# Altium project SAMV71_Xplained_Ultra.PrjPCB (part 3 of 4)

## Sheet SAMV71_Xplained_Ultra_Ethernet.SchDoc: Ethernet
size A3; Organization: ATMEL Norway; Address1: Vestre Rosten 79; Address2: N-7075 TILLER; Address3: NORWAY; DocumentNumber: A09-2407; Revision: 2; SheetNumber: 10; SheetTotal: 13; PageSetup: Record=PageOptions|CenterHorizontal=True|CenterVertical=True|PrintScale=1.04|XCorrection=1.00|YCorrection=1.00|PrintKind=1|BorderSize=5000000|LeftOffset=0|BottomOffset=0|Orientation=2|PaperLength=1000|PaperWidth=1000|Scale=100|PaperSource=7|PrintQuality=-4|MediaType=1|DitherType=10|PrintScaleMode=1|PaperKind=A3 (297 x 420 mm)|PaperIndex=8
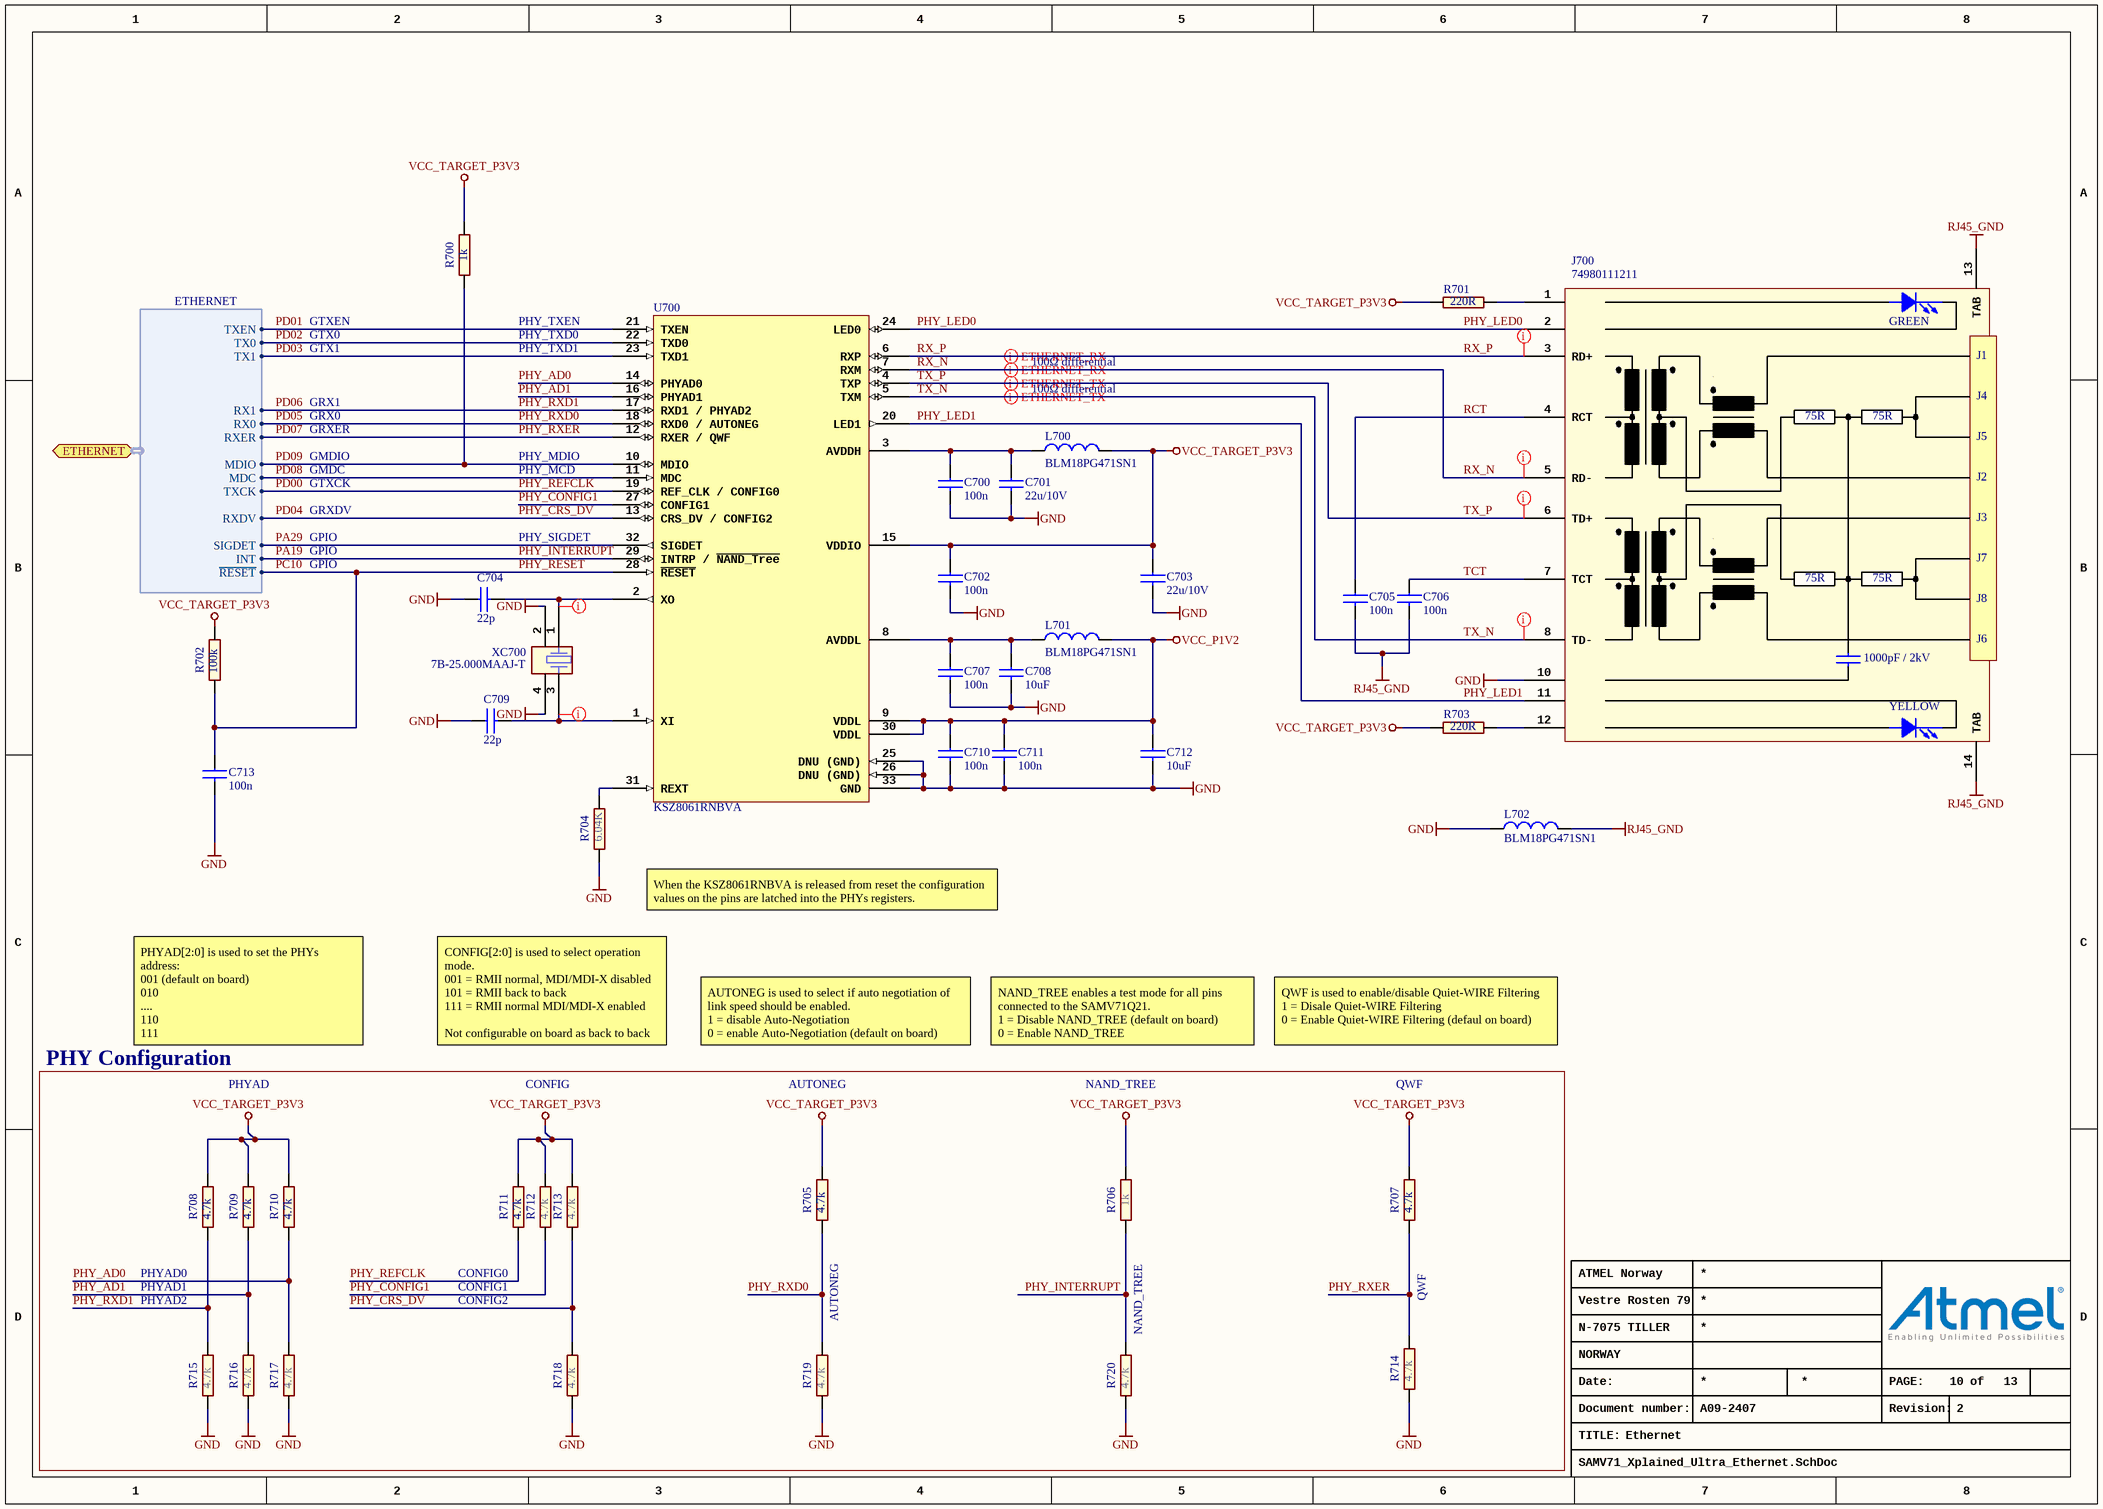
[diagram p7: SAMV71_Xplained_Ultra_Ethernet.SchDoc]

### Parts
C700  value 100n  [AP1-00001]  (hidden comment: CAP-NONPOL)
C701  value 22u/10V  [AP1-00003]  (hidden comment: CAP-NONPOL)
C702  value 100n  [AP1-00001]  (hidden comment: CAP-NONPOL)
C703  value 22u/10V  [AP1-00003]  (hidden comment: CAP-NONPOL)
C704  value 22p  [AP1-00001]  (hidden comment: CAP-NONPOL)
C705  value 100n  [AP1-00001]  (hidden comment: CAP-NONPOL)
C706  value 100n  [AP1-00001]  (hidden comment: CAP-NONPOL)
C707  value 100n  [AP1-00001]  (hidden comment: CAP-NONPOL)
C708  value 10uF  [AP1-00041]  (hidden comment: CAP-NONPOL)
C709  value 22p  [AP1-00001]  (hidden comment: CAP-NONPOL)
C710  value 100n  [AP1-00001]  (hidden comment: CAP-NONPOL)
C711  value 100n  [AP1-00001]  (hidden comment: CAP-NONPOL)
C712  value 10uF  [AP1-00041]  (hidden comment: CAP-NONPOL)
C713  value 100n  [AP1-00001]  (hidden comment: CAP-NONPOL)
J700  value 74980111211  [AP8-00749]  (hidden comment: RJ45)
L700  value BLM18PG471SN1  [AP3-00005]  (hidden comment: INDUCTOR)
L701  value BLM18PG471SN1  [AP3-00005]  (hidden comment: INDUCTOR)
L702  value BLM18PG471SN1  [AP3-00005]  (hidden comment: INDUCTOR)
R700  value 1k  [AP2-00000]  (hidden comment: R2)
R701  value 220R  [AP2-00000]  (hidden comment: R2)
R702  value 100k  [AP2-00000]  (hidden comment: R2)
R703  value 220R  [AP2-00000]  (hidden comment: R2)
R704  value 6.04K  [AP2-00000]  (hidden comment: R2)
R705  value 4.7k  [AP2-00000]  (hidden comment: R2)
R706  value 1k  [AP2-00000]  (hidden comment: R2)
R707  value 4.7k  [AP2-00000]  (hidden comment: R2)
R708  value 4.7k  [AP2-00000]  (hidden comment: R2)
R709  value 4.7k  [AP2-00000]  (hidden comment: R2)
R710  value 4.7k  [AP2-00000]  (hidden comment: R2)
R711  value 4.7k  [AP2-00000]  (hidden comment: R2)
R712  value 4.7k  [AP2-00000]  (hidden comment: R2)
R713  value 4.7k  [AP2-00000]  (hidden comment: R2)
R714  value 4.7k  [AP2-00000]  (hidden comment: R2)
R715  value 4.7k  [AP2-00000]  (hidden comment: R2)
R716  value 4.7k  [AP2-00000]  (hidden comment: R2)
R717  value 4.7k  [AP2-00000]  (hidden comment: R2)
R718  value 4.7k  [AP2-00000]  (hidden comment: R2)
R719  value 4.7k  [AP2-00000]  (hidden comment: R2)
R720  value 4.7k  [AP2-00000]  (hidden comment: R2)
U700  value KSZ8061RNBVA  [AP6-00349]  (hidden comment: KSZ8061RNB)
XC700  value 7B-25.000MAAJ-T  [AP7-00067]  (hidden comment: CRYSTAL1324)

### Blocks framed on the sheet
PHY Configuration: R705-R720

### Ports
ETHERNET (harness ETHERNET)

### Harnesses
ETHERNET: TX0, TX1, TXEN, TXCK, RX0, RX1, MDC, MDIO, RXER, RXDV, INT, ~{RESET}, SIGDET

### Nets
GND: C700.2 C701.2 C702.2 C703.2 C704.1 C707.2 C708.2 C709.1 C710.2 C711.2 C712.2 C713.2 J700.10 L702.1 R704.1 R714.2 R715.2 R716.2 R717.2 R718.1 R719.2 R720.2 U700.25(DNU_(GND)) U700.26(DNU_(GND)) U700.33(GND) XC700.2 XC700.4
RJ45_GND: C705.2 C706.2 J700.13(TAB) J700.14(TAB) L702.2
VCC_P1V2: C710.1 C711.1 C712.1 L701.1 U700.9(VDDL) U700.30(VDDL)
VCC_TARGET_P3V3: C702.1 C703.1 L700.1 R700.2 R701.2 R702.2 R703.1 R705.2 R706.2 R707.2 R708.2 R709.2 R710.2 R711.2 R712.2 R713.2 U700.15(VDDIO)
~{PHY_RESET}: C713.1 R702.1 U700.28(~{RESET}) ; port ETHERNET.~{RESET}  [also labelled PC10]
PA19: R706.1 R720.1 U700.29(INTRP_/_~{NAND_Tree}) ; port ETHERNET.INT  [also labelled PHY_INTERRUPT]
PA29: U700.32(SIGDET) ; port ETHERNET.SIGDET
PD00: R711.1 U700.19(REF_CLK_/_CONFIG0) ; port ETHERNET.TXCK  [also labelled PHY_REFCLK]
PD01: U700.21(TXEN) ; port ETHERNET.TXEN
PD02: U700.22(TXD0) ; port ETHERNET.TX0
PD03: U700.23(TXD1) ; port ETHERNET.TX1
PD04: R713.1 R718.2 U700.13(CRS_DV_/_CONFIG2) ; port ETHERNET.RXDV  [also labelled PHY_CRS_DV]
PD05: R705.1 R719.1 U700.18(RXD0_/_AUTONEG) ; port ETHERNET.RX0  [also labelled PHY_RXD0]
PD06: R708.1 R715.1 U700.17(RXD1_/_PHYAD2) ; port ETHERNET.RX1  [also labelled PHY_RXD1]
PD07: R707.1 R714.1 U700.12(RXER_/_QWF) ; port ETHERNET.RXER  [also labelled PHY_RXER]
PD08: U700.11(MDC) ; port ETHERNET.MDC
PD09: R700.1 U700.10(MDIO) ; port ETHERNET.MDIO
PHY_AD0: R710.1 R717.1 U700.14(PHYAD0)
PHY_AD1: R709.1 R716.1 U700.16(PHYAD1)
PHY_CONFIG1: R712.1 U700.27(CONFIG1)
PHY_LED0: J700.2 U700.24(LED0)
PHY_LED1: J700.11 U700.20(LED1)
RCT: C705.1 J700.4(RCT)
RX_N: J700.5(RD-) U700.7(RXM)
RX_P: J700.3(RD+) U700.6(RXP)
TCT: C706.1 J700.7(TCT)
TX_N: J700.8(TD-) U700.5(TXM)
TX_P: J700.6(TD+) U700.4(TXP)
NetC700_1: C700.1 C701.1 L700.2 U700.3(AVDDH)
NetC704_2: C704.2 U700.2(XO) XC700.1
NetC707_1: C707.1 C708.1 L701.2 U700.8(AVDDL)
NetC709_2: C709.2 U700.1(XI) XC700.3
NetJ700_1: J700.1 R701.1
NetJ700_12: J700.12 R703.2
NetR704_2: R704.2 U700.31(REXT)

### Layout directives
differential pair: RX_N, RX_P, TX_N, TX_P
rule Assembly Testpoint Usage [Testpoint - Not Allowed    Multiple - Not Allowed]; rule Fabrication Testpoint Usage [Testpoint - Not Allowed    Multiple - Not Allowed]: NetC704_2, NetC709_2, RX_N, RX_P, TX_N, TX_P

### Notes on the sheet
- GTXEN
- GTX0
- GTX1
- PHY_TXEN
- PHY_TXD0
- PHY_TXD1
- 100Ω differential
- GRX1
- GRX0
- GRXER
- GMDIO
- GMDC
- GTXCK
- GRXDV
- PHY_MDIO
- PHY_MCD
- GPIO
- PHY_SIGDET
- When the KSZ8061RNBVA is released from reset the configuration values on the pins are latched into the PHYs registers.
- PHYAD[2:0] is used to set the PHYs address:
  001 (default on board)
  010
  ....
  110
  111
- CONFIG[2:0] is used to select operation mode.
  001 = RMII normal, MDI/MDI-X disabled
  101 = RMII back to back
  111 = RMII normal MDI/MDI-X enabled
  Not configurable on board as back to back mode is not applicable for this design.
- AUTONEG is used to select if auto negotiation of link speed should be enabled.
  1 = disable Auto-Negotiation
  0 = enable Auto-Negotiation (default on board)
- NAND_TREE enables a test mode for all pins connected to the SAMV71Q21.
  1 = Disable NAND_TREE (default on board)
  0 = Enable NAND_TREE
- QWF is used to enable/disable Quiet-WIRE Filtering
  1 = Disale Quiet-WIRE Filtering
  0 = Enable Quiet-WIRE Filtering (defaul on board)
- PHYAD
- CONFIG
- AUTONEG
- NAND_TREE
- QWF
- PHYAD0
- PHYAD1
- PHYAD2
- CONFIG0
- CONFIG1
- CONFIG2
- (near R719) AUTONEG
- (near R720) NAND_TREE
- Date:
- PAGE:
- of
- TITLE:
- Document number:
- Revision:
- (in symbol A08-1816) GREEN; J1; J4; 75R; J5; J2; J3; J7; J8; J6; 1000pF / 2kV; YELLOW

### Library data of the parts
C700 C702 C705-C707 C710 C711 C713 = A01-0246: as C105 on sheet SAMV71_Xplained_Ultra_Power_Multiplexer; AN: A01-0246; Tolerance: 16V, +/-10%; Height: 0,5
C701 C703 = A01-0500: Ceramic capacitor, SMD 0805, X5R, 10V, ±20%; PartGroup: Capacitors,Ceramic,SMD 0805; Manufacturer: tdk; MPN: C2012X5R1A226M/0.85; TemperatureRange: -55°C to +85°C; AN: A01-0500; Height: 0,949999988079071
C704 C709 = A01-0019: Ceramic capacitor, SMD 0402, NP0, 50V, +/-5%; PartGroup: Capacitors,Ceramic,SMD 0402; TemperatureRange: -55 - +125 deg C; AN: A01-0019; Tolerance: 50V, +/-5%; Height: 0.550000011920929
C708 C712 = A01-0360: Ceramic capacitor, SMD 0805, X7R, 10V, 10 %, (de19441); PartGroup: Capacitors,Ceramic,SMD 0805; Manufacturer: Murata; MPN: GRM21BR61A106KE19L; Tolerance: 10%; TemperatureRange: -55 - +85 deg C; AN: A01-0360; Height: 1,25
J700 = A08-1816: 10/100Base-TX, SMD, RJ45, green and yellow LEDs, integrated magnetics; PartGroup: Mechanical devices,Connectors,Other; Manufacturer: Würth Elektronik; TemperatureRange: -40°C to +85°C; AN: A08-1816; Height: 13,6099996566772; MPN: 74980111211
L700-L702 = A03-0035: SMD RF inductor 0603. Z=470Ohm (@100MHz), Max R(dc)=0.65Ohm, Max current=1A; PartGroup: Inductors,EMI; Manufacturer: Murata; Tolerance: ±25%; TemperatureRange: -55°C to +125°C; AN: A03-0035; Height: 0,800000011920929; MPN: BLM18PG471SN1
R700 R706 = A02-0212: Thick film resistor, SMD 0402, 1/16W, 1%; PartGroup: Resistors,SMD,0402 1%; TemperatureRange: -55 - +125 deg C; AN: A02-0212; Tolerance: 1 %; Height: 0,349999994039536
R701 R703 = A02-0196: Thick film resistor, SMD 0402, 1/16W, 1%; PartGroup: Resistors,SMD,0402 1%; TemperatureRange: -55 - +125 deg C; AN: A02-0196; Tolerance: 1 %; Height: 0.349999994039536
R702 = A02-0260: as R106 on sheet SAMV71_Xplained_Ultra_Power_Supply; AN: A02-0260; Tolerance: 1 %; Height: 0,349999994039536
R704 = A02-0914: Thick film resistor, SMD 0402, 1/16W, 1%, E192; PartGroup: Resistors,SMD,0402 1%; TemperatureRange: -55 - +125 deg C; AN: A02-0914; Tolerance: 1%; Height: 0,349999994039536
R705 R707-R711 = A02-0228: Thick film resistor, SMD 0402, 1/16W, 1%; PartGroup: Resistors,SMD,0402 1%; TemperatureRange: -55 - +125 deg C; AN: A02-0228; Tolerance: 1 %; Height: 0.349999994039536
R712-R720 = A02-0228: Thick film resistor, SMD 0402, 1/16W, 1%; PartGroup: Resistors,SMD,0402 1%; TemperatureRange: -55ï¿½ to +125ï¿½C; AN: A02-0228; Tolerance: 1 %; Height: 0,349999994039536
U700 = A06-1163: 10Base-T/100Base-TX PHY, RMII, EEE, 50MHz clock output, AEC-Q100 Automotive; PartGroup: Integrated Circuits,Interface ICs,Ethernet; TemperatureRange: -40Â°C to +105Â°C; AN: A06-1163; Height: 0,850000023841858
XC700 = A07-0088: 25.000 MHz crystal, 18pF, ±30ppm, 5.0 x 3.2 mm; PartGroup: Frequency devices,Crystals,SMD; Manufacturer: TXC Corporation; TemperatureRange: -40°C to +85°C; AN: A07-0088; Tolerance: ±30ppm; Height: 1,04999995231628; MPN: 7B-25.000MAAJ-T

## Sheet SAMV71_Xplained_Ultra_Memory.SchDoc: Memory
size A3; Organization: ATMEL Norway; Address1: Vestre Rosten 79; Address2: N-7075 TILLER; Address3: NORWAY; DocumentNumber: A09-2407; Revision: 2; SheetNumber: 9; SheetTotal: 13; PageSetup: Record=PageOptions|CenterHorizontal=True|CenterVertical=True|PrintScale=1.01|XCorrection=1.00|YCorrection=1.00|PrintKind=1|BorderSize=5000000|LeftOffset=0|BottomOffset=0|Orientation=2|PaperLength=1000|PaperWidth=1000|Scale=100|PaperSource=7|PrintQuality=-4|MediaType=1|DitherType=10|PaperKind=A3 (297 x 420 mm)|PrintScaleMode=1
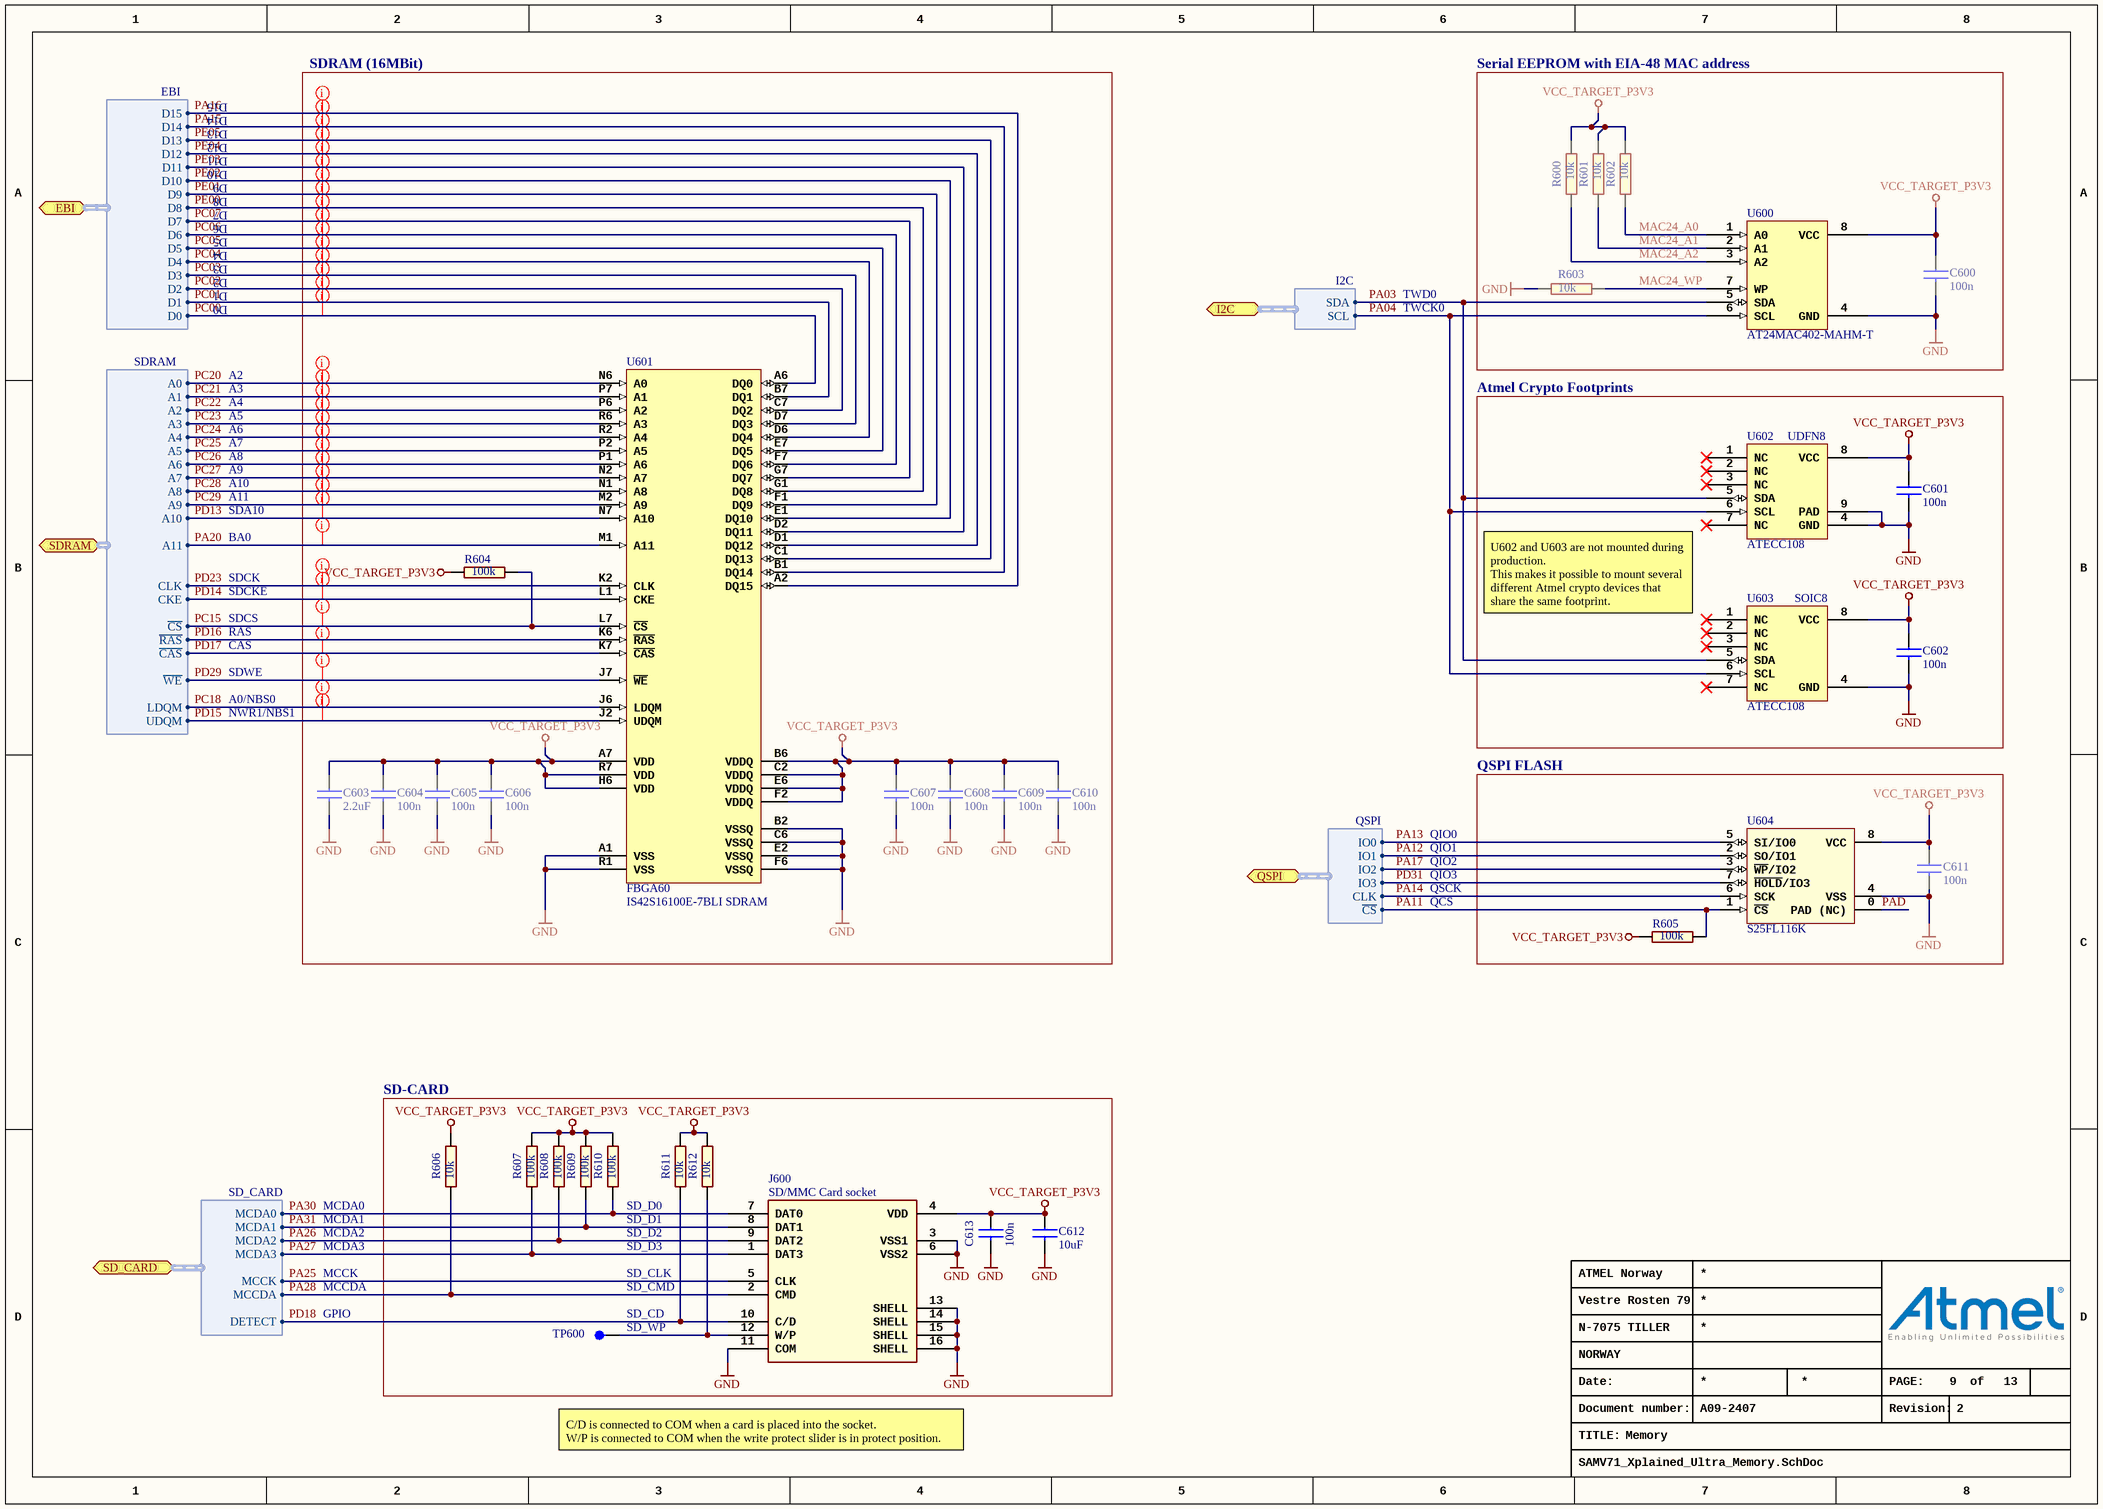
[diagram p8: SAMV71_Xplained_Ultra_Memory.SchDoc]

### Parts
C600  value 100n  [AP1-00001]  (hidden comment: CAP-NONPOL)
C601  value 100n  [AP1-00001]  (hidden comment: CAP-NONPOL)
C602  value 100n  [AP1-00001]  (hidden comment: CAP-NONPOL)
C603  value 2.2uF  [AP1-00053]  (hidden comment: Farnell no: 1288200)
C604  value 100n  [AP1-00053]  (hidden comment: CAP-NONPOL)
C605  value 100n  [AP1-00053]  (hidden comment: CAP-NONPOL)
C606  value 100n  [AP1-00053]  (hidden comment: CAP-NONPOL)
C607  value 100n  [AP1-00053]  (hidden comment: CAP-NONPOL)
C608  value 100n  [AP1-00053]  (hidden comment: CAP-NONPOL)
C609  value 100n  [AP1-00053]  (hidden comment: CAP-NONPOL)
C610  value 100n  [AP1-00053]  (hidden comment: CAP-NONPOL)
C611  value 100n  [AP1-00001]  (hidden comment: CAP-NONPOL)
C612  value 10uF  [AP1-00041]
C613  value 100n  [AP1-00001]  (hidden comment: CAP-NONPOL)
J600  SD/MMC Card socket  [AP8-00377]
R600  value 10k  [AP2-00000]  (hidden comment: R2)
R601  value 10k  [AP2-00000]  (hidden comment: R2)
R602  value 10k  [AP2-00000]  (hidden comment: R2)
R603  value 10k  [AP2-00000]  (hidden comment: R2)
R604  value 100k  [AP2-00000]  (hidden comment: R2)
R605  value 100k  [AP2-00000]  (hidden comment: R2)
R606  value 10k  [AP2-00000]  (hidden comment: R2)
R607  value 100k  [AP2-00000]  (hidden comment: R2)
R608  value 100k  [AP2-00000]  (hidden comment: R2)
R609  value 100k  [AP2-00000]  (hidden comment: R2)
R610  value 100k  [AP2-00000]  (hidden comment: R2)
R611  value 10k  [AP2-00000]  (hidden comment: R2)
R612  value 10k  [AP2-00000]  (hidden comment: R2)
TP600  TESTPOINT  [AP8-00010]  (value not drawn)  (no BOM)
U600  value AT24MAC402-MAHM-T  [AP6-00186]  (hidden comment: AT24MAC-8PIN)
U601  FBGA60  value IS42S16100E-7BLI SDRAM  [AP6-00400]
U602  value ATECC108  [AP6-00409]  (hidden comment: SOIC-8 / UDFN8 2x3mm (8MA2) footprint used for this component, usually for "not mounted" in schematics to support several Crypto devices.)
U603  value ATECC108  [AP6-00071]  (hidden comment: SOIC-8 / UDFN8 2x3mm (8MA2) footprint used for this component, usually for "not mounted" in schematics to support several Crypto devices.)
U604  value S25FL116K  [AP6-00402]  (hidden comment: Also available as 32- and 64-Mbit.)

### Blocks framed on the sheet
SDRAM (16MBit): C603-C610 R604 U601
Serial EEPROM with EIA-48 MAC address: C600 R600-R603 U600
Atmel Crypto Footprints: C601 C602 U602 U603
QSPI FLASH: C611 R605 U604
SD-CARD: C612 C613 J600 R606-R612 TP600

### Ports
EBI (harness EBI), I2C (harness I2C), QSPI (harness QSPI), SD_CARD (harness SD_CARD), SDRAM (harness SDRAM)

### Harnesses
SD_CARD: MCCDA, MCCK, MCDA3, MCDA2, MCDA1, MCDA0, DETECT
EBI: D0, D1, D2, D3, D4, D5, D6, D7, D8, D9, D10, D11, D12, D13, D14, D15
QSPI: CLK, IO3, IO2, IO0, IO1, ~{CS}
SDRAM: ~{CAS}, ~{RAS}, ~{CS}, CLK, CKE, ~{WE}, LDQM, UDQM, A0, A1, A2, A3, A4, A5, A6, A7, A8, A9, A10, A11
I2C: SDA, SCL

### Nets
GND: C600.2 C601.2 C602.2 C603.2 C604.2 C605.2 C606.2 C607.2 C608.2 C609.2 C610.2 C611.2 C612.2 C613.2 J600.3(VSS1) J600.6(VSS2) J600.11(COM) J600.13(SHELL) J600.14(SHELL) J600.15(SHELL) J600.16(SHELL) R603.1 U600.4(GND) U601.A1(VSS) U601.B2(VSSQ) U601.C6(VSSQ) U601.E2(VSSQ) U601.F6(VSSQ) U601.R1(VSS) U602.4(GND) U602.9(PAD) U603.4(GND) U604.4(VSS)
VCC_TARGET_P3V3: C600.1 C601.1 C602.1 C603.1 C604.1 C605.1 C606.1 C607.1 C608.1 C609.1 C610.1 C611.1 C612.1 C613.1 J600.4(VDD) R600.2 R601.2 R602.2 R604.1 R605.1 R606.2 R607.2 R608.2 R609.2 R610.2 R611.2 R612.2 U600.8(VCC) U601.A7(VDD) U601.B6(VDDQ) U601.C2(VDDQ) U601.E6(VDDQ) U601.F2(VDDQ) U601.H6(VDD) U601.R7(VDD) U602.8(VCC) U603.8(VCC) U604.8(VCC)
MAC24_A0: R602.1 U600.1(A0)
MAC24_A1: R601.1 U600.2(A1)
MAC24_A2: R600.1 U600.3(A2)
MAC24_WP: R603.2 U600.7(WP)
PA03: U600.5(SDA) U602.5(SDA) U603.5(SDA) ; port I2C.SDA
PA04: U600.6(SCL) U602.6(SCL) U603.6(SCL) ; port I2C.SCL
PA11: R605.2 U604.1(~{CS}) ; port QSPI.~{CS}
PA12: U604.2(SO/IO1) ; port QSPI.IO1
PA13: U604.5(SI/IO0) ; port QSPI.IO0
PA14: U604.6(SCK) ; port QSPI.CLK
PA15: U601.B1(DQ14) ; port EBI.D14
PA16: U601.A2(DQ15) ; port EBI.D15
PA17: U604.3(~{WP}/IO2) ; port QSPI.IO2
PA20: U601.M1(A11) ; port SDRAM.A11
PA25: J600.5(CLK) ; port SD_CARD.MCCK
PA26: J600.9(DAT2) R608.1 ; port SD_CARD.MCDA2
PA27: J600.1(DAT3) R607.1 ; port SD_CARD.MCDA3
PA28: J600.2(CMD) R606.1 ; port SD_CARD.MCCDA
PA30: J600.7(DAT0) R610.1 ; port SD_CARD.MCDA0
PA31: J600.8(DAT1) R609.1 ; port SD_CARD.MCDA1
PAD: U604.0(PAD_(NC))
PC00: U601.A6(DQ0) ; port EBI.D0
PC01: U601.B7(DQ1) ; port EBI.D1
PC02: U601.C7(DQ2) ; port EBI.D2
PC03: U601.D7(DQ3) ; port EBI.D3
PC04: U601.D6(DQ4) ; port EBI.D4
PC05: U601.E7(DQ5) ; port EBI.D5
PC06: U601.F7(DQ6) ; port EBI.D6
PC07: U601.G7(DQ7) ; port EBI.D7
PC15: R604.2 U601.L7(~{CS}) ; port SDRAM.~{CS}
PC18: U601.J6(LDQM) ; port SDRAM.LDQM
PC20: U601.N6(A0) ; port SDRAM.A0
PC21: U601.P7(A1) ; port SDRAM.A1
PC22: U601.P6(A2) ; port SDRAM.A2
PC23: U601.R6(A3) ; port SDRAM.A3
PC24: U601.R2(A4) ; port SDRAM.A4
PC25: U601.P2(A5) ; port SDRAM.A5
PC26: U601.P1(A6) ; port SDRAM.A6
PC27: U601.N2(A7) ; port SDRAM.A7
PC28: U601.N1(A8) ; port SDRAM.A8
PC29: U601.M2(A9) ; port SDRAM.A9
PD13: U601.N7(A10) ; port SDRAM.A10
PD14: U601.L1(CKE) ; port SDRAM.CKE
PD15: U601.J2(UDQM) ; port SDRAM.UDQM
PD16: U601.K6(~{RAS}) ; port SDRAM.~{RAS}
PD17: U601.K7(~{CAS}) ; port SDRAM.~{CAS}
PD18: J600.10(C/D) R611.1 ; port SD_CARD.DETECT
PD23: U601.K2(CLK) ; port SDRAM.CLK
PD29: U601.J7(~{WE}) ; port SDRAM.~{WE}
PD31: U604.7(~{HOLD}/IO3) ; port QSPI.IO3
PE00: U601.G1(DQ8) ; port EBI.D8
PE01: U601.F1(DQ9) ; port EBI.D9
PE02: U601.E1(DQ10) ; port EBI.D10
PE03: U601.D2(DQ11) ; port EBI.D11
PE04: U601.D1(DQ12) ; port EBI.D12
PE05: U601.C1(DQ13) ; port EBI.D13
NetJ600_12: J600.12(W/P) R612.1 TP600.1

Not connected (* = marked no-connect by the designer): U602 1(NC)* 2(NC)* 3(NC)* 7(NC)*; U603 1(NC)* 2(NC)* 3(NC)* 7(NC)*

### Layout directives
net class DATA_BUS: PA15, PA16, PC00, PC01, PC02, PC03, PC04, PC05, PC06, PC07, PC18, PD15, PE00, PE01, PE02, PE03, PE04, PE05
net class ADDRESS_BUS: PA20, PC15, PC20, PC21, PC22, PC23, PC24, PC25, PC26, PC27, PC28, PC29, PD13, PD14, PD17, PD23, PD29

### Notes on the sheet
- D14
- D15
- D9
- D10
- D11
- D12
- D13
- D4
- D5
- D6
- D7
- D8
- D0
- D1
- D2
- D3
- TWCK0
- TWD0
- A2
- A3
- A4
- A5
- A6
- A7
- (near U602) UDFN8
- A8
- A9
- A10
- A11
- SDA10
- BA0
- SDCK
- SDCKE
- SDCS
- RAS
- CAS
- U602 and U603 are not mounted during production.
  This makes it possible to mount several different Atmel crypto devices that share the same footprint.
- (near U603) SOIC8
- A0/NBS0
- NWR1/NBS1
- SDWE
- QIO0
- QIO1
- QIO2
- QIO3
- QSCK
- QCS
- MCDA0
- MCDA1
- MCDA2
- MCDA3
- SD_D0
- SD_D1
- SD_D2
- SD_D3
- GPIO
- MCCK
- MCCDA
- SD_CLK
- (near TP600) SD_CMD
- (near TP600) SD_CD
- (near TP600) SD_WP
- C/D is connected to COM when a card is placed into the socket.
  W/P is connected to COM when the write protect slider is in protect position.
- Date:
- PAGE:
- of
- TITLE:
- Document number:
- Revision:

### Library data of the parts
C600-C602 C604-C611 C613 = A01-0246: Ceramic capacitor, SMD 0402, X7R, 16V, +/-10%; PartGroup: Capacitors,Ceramic,SMD 0402; Manufacturer: Kemet; MPN: C0402C104K4RACTU; TemperatureRange: -55 - +125 deg C; AN: A01-0246; Tolerance: 16V, +/-10%
  C600-C602 C604-C611: Height: 0.5
  C613: Height: 0,5
C603 = A01-0300: Ceramic capacitor, SMD 0402, X5R, 6.3V, +/-20%; PartGroup: Capacitors,Ceramic,SMD 0402; Manufacturer: Kemet; MPN: C0402C225M9PAC; Tolerance: Â±20%; TemperatureRange: -55Â°C to +85Â°C; AN: A01-0300; Height: 0.5
C612 = A01-0360: Ceramic capacitor, SMD 0805, X5R, 10V, 10 %, (de19441); PartGroup: Capacitors,Ceramic,SMD 0805; Manufacturer: Murata; MPN: GRM21BR61A106KE19L; Tolerance: 10%; TemperatureRange: -55 - +85 deg C; AN: A01-0360; Height: 1,25
J600 = A08-0816: SD/MMC socket, 2.7mm, push-push, SMD; PartGroup: Mechanical devices,Connectors,Memory cards; Manufacturer: Kyocera-elco; Value: KYOCERA - 14 5738 009 220 859+; TemperatureRange: -25 deg C to 90 deg C; AN: A08-0816; Height: 2.70000004768372; MPN: KYOCERA - 14 5738 009 220 859+
R600-R603 = A02-0236: Thick film resistor, SMD 0402, 1/16W, 1%; PartGroup: Resistors,SMD,0402 1%; Manufacturer: vishay; MPN: CRCW040210K0FKED; TemperatureRange: -55 - +125 deg C; AN: A02-0236; Tolerance: 1 %; Height: 0,349999994039536
R604 R605 = A02-0260: Thick film resistor, SMD 0402, 1/16W, 1%; PartGroup: Resistors,SMD,0402 1%; TemperatureRange: -55ï¿½ to +125ï¿½C; AN: A02-0260; Tolerance: 1 %; Height: 0.349999994039536
R606 R611 R612 = A02-0236: Thick film resistor, SMD 0402, 1/16W, 1%; PartGroup: Resistors,SMD,0402 1%; TemperatureRange: -55 - +125 deg C; AN: A02-0236; Tolerance: 1 %; Height: 0.349999994039536
R607-R610 = A02-0260: Thick film resistor, SMD 0402, 1/16W, 1%; PartGroup: Resistors,SMD,0402 1%; TemperatureRange: -55 - +125 deg C; AN: A02-0260; Tolerance: 1 %; Height: 0.349999994039536
TP600 = A08-0004: Single SMD testpad; PartGroup: Mechanical devices,Connectors,Test points; AN: A08-0004; Value: TESTPAD; Height: 0
U600 = A06-1169: 2kbit I2C EEPROM, single EUI-48 MAC, 1.7-5.5V, 2x3mm UDFN (8MA2); PartGroup: Integrated Circuits,Memory,EEPROM; TemperatureRange: â€“40Â°C to +85Â°C; AN: A06-1169; Height: 0,600000023841858
U601 = A06-1155: 16Mbit  SDRAM (512K Words x 16 Bits x 2 Banks), 143 MHz 3,3V; PartGroup: Integrated Circuits,Memory,SDRAM; TemperatureRange: -40C to +85C; AN: A06-1155; Height: 1,20000004768372
U602 = A06-1181: Secure authentication and product validation device, EEPROM, I2C, 2.0 - 5.5V, UDFN8; PartGroup: Integrated Circuits,Special function,Encryption; TemperatureRange: -40Â°C to +85Â°C; AN: A06-1181; Height: 1,75
U603 = A06-1182: Secure authentication and product validation device, EEPROM, I2C, 2.0 - 5.5V, SOIC8; PartGroup: Integrated Circuits,Special function,Encryption; TemperatureRange: -40Â°C to +85Â°C; AN: A06-1182; Height: 1,75
U604 = A06-1162: 16 Mbit (2MB) SPI Quad I/O flash, 3.3V, 108MHz, WSON-8, industrial temperature; PartGroup: Integrated Circuits,Memory,FLASH; TemperatureRange: -40Â°C to +85Â°C; AN: A06-1162; Height: 0,800000011920929

## Sheet SAMV71_Xplained_Ultra_Shield_Connectors.SchDoc: Shield Connectors
size A3; Organization: ATMEL Norway; Address1: Vestre Rosten 79; Address2: N-7075 TILLER; Address3: NORWAY; DocumentNumber: A09-2407; Revision: 2; SheetNumber: 8; SheetTotal: 13; PageSetup: Record=PageOptions|CenterHorizontal=True|CenterVertical=True|PrintScale=1.01|XCorrection=1.00|YCorrection=1.00|PrintKind=1|BorderSize=5000000|LeftOffset=0|BottomOffset=0|Orientation=2|PaperLength=1000|PaperWidth=1000|Scale=100|PaperSource=7|PrintQuality=-4|MediaType=1|DitherType=10|PaperKind=A3 (297 x 420 mm)|PrintScaleMode=1
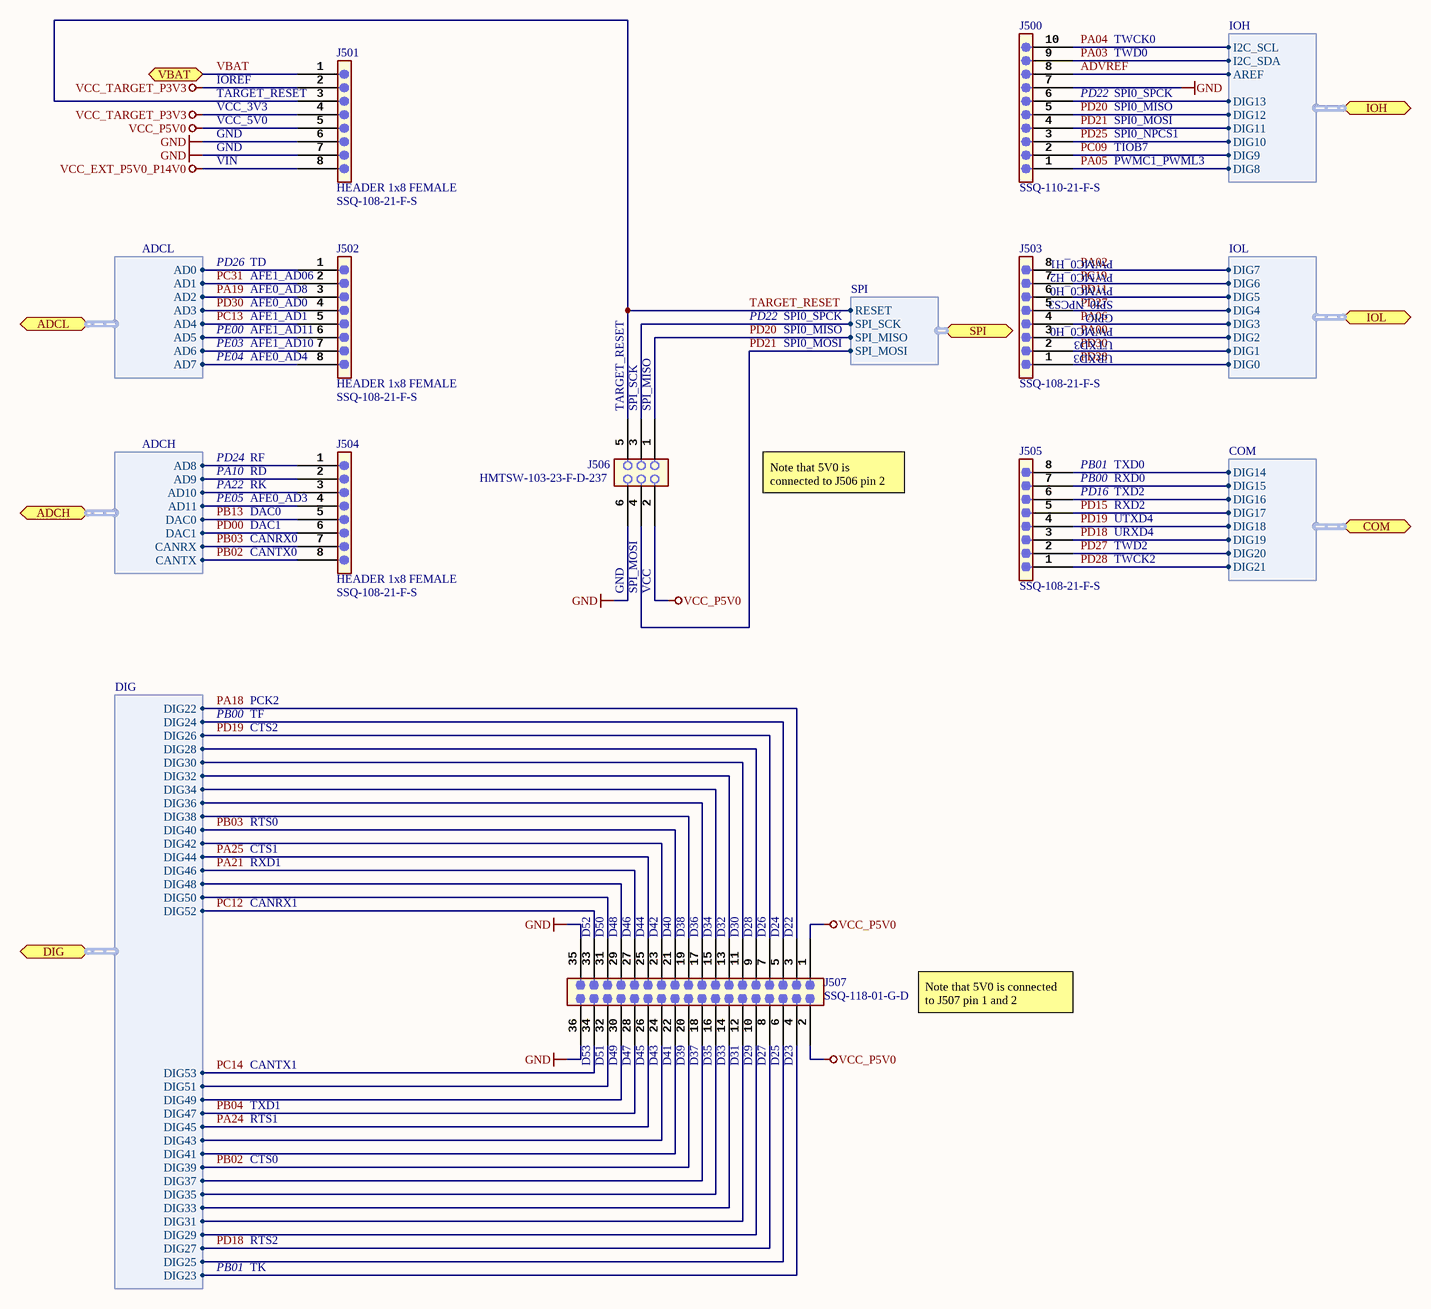
[diagram p9: SAMV71_Xplained_Ultra_Shield_Connectors.SchDoc]

### Parts
J500  value SSQ-110-21-F-S  [AP8-00822]  (hidden comment: HEADER 1x10 FEMALE)
J501  HEADER 1x8 FEMALE  value SSQ-108-21-F-S  [AP8-00823]
J502  HEADER 1x8 FEMALE  value SSQ-108-21-F-S  [AP8-00823]
J503  value SSQ-108-21-F-S  [AP8-00823]  (hidden comment: HEADER 1x8 FEMALE)
J504  HEADER 1x8 FEMALE  value SSQ-108-21-F-S  [AP8-00823]
J505  value SSQ-108-21-F-S  [AP8-00823]  (hidden comment: HEADER 1x8 FEMALE)
J506  value HMTSW-103-23-F-D-237  [AP8-00182]  (hidden comment: HEADER 2x3)
J507  value SSQ-118-01-G-D  [AP8-00259]  (hidden comment: HEADER 2x18 FEMALE)

### Ports
ADCH (harness ADCH), ADCL (harness ADCL), COM (harness COM), DIG (harness DIG), IOH (harness IOH), IOL (harness IOL), SPI (harness SPI), VBAT (bidir)

### Harnesses
IOH: DIG8, DIG9, DIG10, DIG11, DIG12, DIG13, AREF, I2C_SCL, I2C_SDA
IOL: DIG0, DIG1, DIG2, DIG3, DIG4, DIG5, DIG6, DIG7
COM: DIG14, DIG15, DIG16, DIG17, DIG18, DIG19, DIG20, DIG21
ADCL: AD0, AD1, AD2, AD3, AD4, AD5, AD6, AD7
ADCH: AD8, AD9, AD10, AD11, DAC0, DAC1, CANRX, CANTX
DIG: DIG22, DIG23, DIG24, DIG25, DIG26, DIG27, DIG28, DIG29, DIG30, DIG31, DIG32, DIG33, DIG34, DIG35, DIG36, DIG37, DIG38, DIG39, DIG40, DIG41, DIG42, DIG43, DIG44, DIG45, DIG46, DIG47, DIG48, DIG49, DIG50, DIG51, DIG52, DIG53
SPI: SPI_MISO, SPI_MOSI, SPI_SCK, RESET

### Nets
GND: J500.7 J501.6 J501.7 J506.6 J507.35 J507.36
VCC_EXT_P5V0_P14V0: J501.8
VCC_P5V0: J501.5 J506.2 J507.1 J507.2
VCC_TARGET_P3V3: J501.2 J501.4
ADVREF: J500.8 ; port IOH.AREF
PA00: J503.3 ; port IOL.DIG2
PA02: J503.8 ; port IOL.DIG7
PA03: J500.9 ; port IOH.I2C_SDA
PA04: J500.10 ; port IOH.I2C_SCL
PA05: J500.1 ; port IOH.DIG8
PA06: J503.4 ; port IOL.DIG3
PA18: J507.3 ; port DIG.DIG22
PA19: J502.3 ; port ADCL.AD2
PA21: J507.27 ; port DIG.DIG46
PA24: J507.26 ; port DIG.DIG45
PA25: J507.25 ; port DIG.DIG44
PB02: J504.8 J507.20 ; port ADCH.CANTX, port DIG.DIG39
PB03: J504.7 J507.21 ; port ADCH.CANRX, port DIG.DIG40
PB04: J507.28 ; port DIG.DIG47
PB13: J504.5 ; port ADCH.DAC0
PC09: J500.2 ; port IOH.DIG9
PC12: J507.33 ; port DIG.DIG52
PC13: J502.5 ; port ADCL.AD4
PC14: J507.34 ; port DIG.DIG53
PC19: J503.7 ; port IOL.DIG6
PC31: J502.2 ; port ADCL.AD1
PD00: J504.6 ; port ADCH.DAC1
PD11: J503.6 ; port IOL.DIG5
PD15: J505.5 ; port COM.DIG17
PD18: J505.3 J507.8 ; port COM.DIG19, port DIG.DIG27
PD19: J505.4 J507.7 ; port COM.DIG18, port DIG.DIG26
PD20: J500.5 J506.1 ; port IOH.DIG12, port SPI.SPI_MISO
PD21: J500.4 J506.4 ; port IOH.DIG11, port SPI.SPI_MOSI
PD25: J500.3 ; port IOH.DIG10
PD27: J503.5 J505.2 ; port IOL.DIG4, port COM.DIG20
PD28: J503.1 J505.1 ; port IOL.DIG0, port COM.DIG21
PD30: J502.4 J503.2 ; port IOL.DIG1, port ADCL.AD3
TARGET_RESET: J501.3 J506.5 ; port SPI.RESET
VBAT: J501.1 ; port VBAT
NetJ500_6: J500.6 ; port IOH.DIG13
NetJ502_1: J502.1 ; port ADCL.AD0
NetJ502_6: J502.6 ; port ADCL.AD5
NetJ502_7: J502.7 ; port ADCL.AD6
NetJ502_8: J502.8 ; port ADCL.AD7
NetJ504_1: J504.1 ; port ADCH.AD8
NetJ504_2: J504.2 ; port ADCH.AD9
NetJ504_3: J504.3 ; port ADCH.AD10
NetJ504_4: J504.4 ; port ADCH.AD11
NetJ505_6: J505.6 ; port COM.DIG16
NetJ505_7: J505.7 ; port COM.DIG15
NetJ505_8: J505.8 ; port COM.DIG14
NetJ506_3: J506.3 ; port SPI.SPI_SCK
NetJ507_4: J507.4 ; port DIG.DIG23
NetJ507_5: J507.5 ; port DIG.DIG24
NetJ507_6: J507.6 ; port DIG.DIG25
NetJ507_9: J507.9 ; port DIG.DIG28
NetJ507_10: J507.10 ; port DIG.DIG29
NetJ507_11: J507.11 ; port DIG.DIG30
NetJ507_12: J507.12 ; port DIG.DIG31
NetJ507_13: J507.13 ; port DIG.DIG32
NetJ507_14: J507.14 ; port DIG.DIG33
NetJ507_15: J507.15 ; port DIG.DIG34
NetJ507_16: J507.16 ; port DIG.DIG35
NetJ507_17: J507.17 ; port DIG.DIG36
NetJ507_18: J507.18 ; port DIG.DIG37
NetJ507_19: J507.19 ; port DIG.DIG38
NetJ507_22: J507.22 ; port DIG.DIG41
NetJ507_23: J507.23 ; port DIG.DIG42
NetJ507_24: J507.24 ; port DIG.DIG43
NetJ507_29: J507.29 ; port DIG.DIG48
NetJ507_30: J507.30 ; port DIG.DIG49
NetJ507_31: J507.31 ; port DIG.DIG50
NetJ507_32: J507.32 ; port DIG.DIG51

### Notes on the sheet
- TWD0
- TWCK0
- (near J501) TARGET_RESET
- IOREF
- VCC_3V3
- VCC_5V0
- (near J500) PD22
- SPI0_SPCK
- SPI0_MOSI
- SPI0_MISO
- GND
- VIN
- SPI0_NPCS1
- PWMC1_PWML3
- TIOB7
- PD26
- TD
- PWMC0_H2
- PWMC0_H1
- (near J502) AFE0_AD8
- (near J502) AFE1_AD1
- (near J502) AFE0_AD0
- (near J502) AFE1_AD06
- PD22
- SPI0_NPCS3
- PWMC0_H0
- GPIO
- PE00
- PE03
- PE04
- (near J502) AFE1_AD11
- (near J502) AFE1_AD10
- (near J502) AFE0_AD4
- URXD3
- UTXD3
- PD24
- RF
- (near J506) TARGET_RESET
- (near J506) SPI_SCK
- (near J506) SPI_MISO
- PA10
- PA22
- PE05
- DAC0
- DAC1
- RD
- RK
- (near J504) AFE0_AD3
- Note that 5V0 is connected to J506 pin 2
- (near J505) PB01
- (near J505) PB00
- (near J505) PD16
- TXD2
- RXD2
- UTXD4
- URXD4
- TXD0
- RXD0
- (near J504) CANRX0
- (near J504) CANTX0
- SPI_MOSI
- VCC
- TWD2
- TWCK2
- PB00
- PCK2
- TF
- CTS2
- RTS0
- CTS1
- RXD1
- CANRX1
- (near J507) D52
- (near J507) D50
- (near J507) D48
- (near J507) D46
- (near J507) D44
- (near J507) D42
- (near J507) D40
- (near J507) D38
- (near J507) D36
- (near J507) D34
- (near J507) D32
- (near J507) D30
- (near J507) D28
- (near J507) D26
- (near J507) D24
- (near J507) D22
- CANTX1
- (near J507) D53
- (near J507) D51
- (near J507) D49
- (near J507) D47
- (near J507) D45
- (near J507) D43
- (near J507) D41
- (near J507) D39
- (near J507) D37
- (near J507) D35
- (near J507) D33
- (near J507) D31
- (near J507) D29
- (near J507) D27
- (near J507) D25
- (near J507) D23
- Note that 5V0 is connected to J507 pin 1 and 2
- RTS1
- TXD1
- CTS0
- PB01
- TK
- RTS2
- Date:
- PAGE:
- of
- TITLE:
- Document number:
- Revision:

### Library data of the parts
J500 = A08-2026: 1x10 receptacle pin header, low insertion force, 2.54mm pitch THM, Pin in Paste; PartGroup: Mechanical devices,Connectors,Pin header receptacle; Manufacturer: SAMTEC; AN: A08-2026; Height: 8,51000022888184; MPN: SSQ-110-21-F-S
J501-J505 = A08-2025: 1x8 receptacle pin header, low insertion force, 2.54mm pitch THM, Pin in Paste; PartGroup: Mechanical devices,Connectors,Pin header receptacle; Manufacturer: SAMTEC; AN: A08-2025; Height: 8,51000022888184; MPN: SSQ-108-21-F-S
J506 = A08-1654: 2x3 pin header, 2.54mm pitch, Pin-in-Paste THM; PartGroup: Mechanical devices,Connectors,Pin headers; Manufacturer: SAMTEC; TemperatureRange: - 55 ï¿½C to + 125 ï¿½C; AN: A08-1654; Height: 6,09999990463257; MPN: HMTSW-103-23-F-D-237
J507 = A08-0387: 2x18 female pin header, 2.54mm pitch, THM; PartGroup: Mechanical devices,Connectors,Pin header receptacle; Manufacturer: SAMTEC; TemperatureRange: -55 - +125 degC; AN: A08-0387; Height: 8,51000022888184; MPN: SSQ-118-01-G-D

## Sheet SAMV71_Xplained_Ultra_Audio.SchDoc: Audio
size A3; Organization: ATMEL Norway; Address1: Vestre Rosten 79; Address2: N-7075 TILLER; Address3: NORWAY; DocumentNumber: A09-2407; Revision: 2; SheetNumber: 11; SheetTotal: 13; PageSetup: Record=PageOptions|CenterHorizontal=True|CenterVertical=True|PrintScale=1.01|XCorrection=1.00|YCorrection=1.00|PrintKind=1|BorderSize=5000000|LeftOffset=0|BottomOffset=0|Orientation=2|PaperLength=1000|PaperWidth=1000|Scale=100|PaperSource=7|PrintQuality=-4|MediaType=1|DitherType=10|PaperKind=A3 (297 x 420 mm)|PrintScaleMode=1
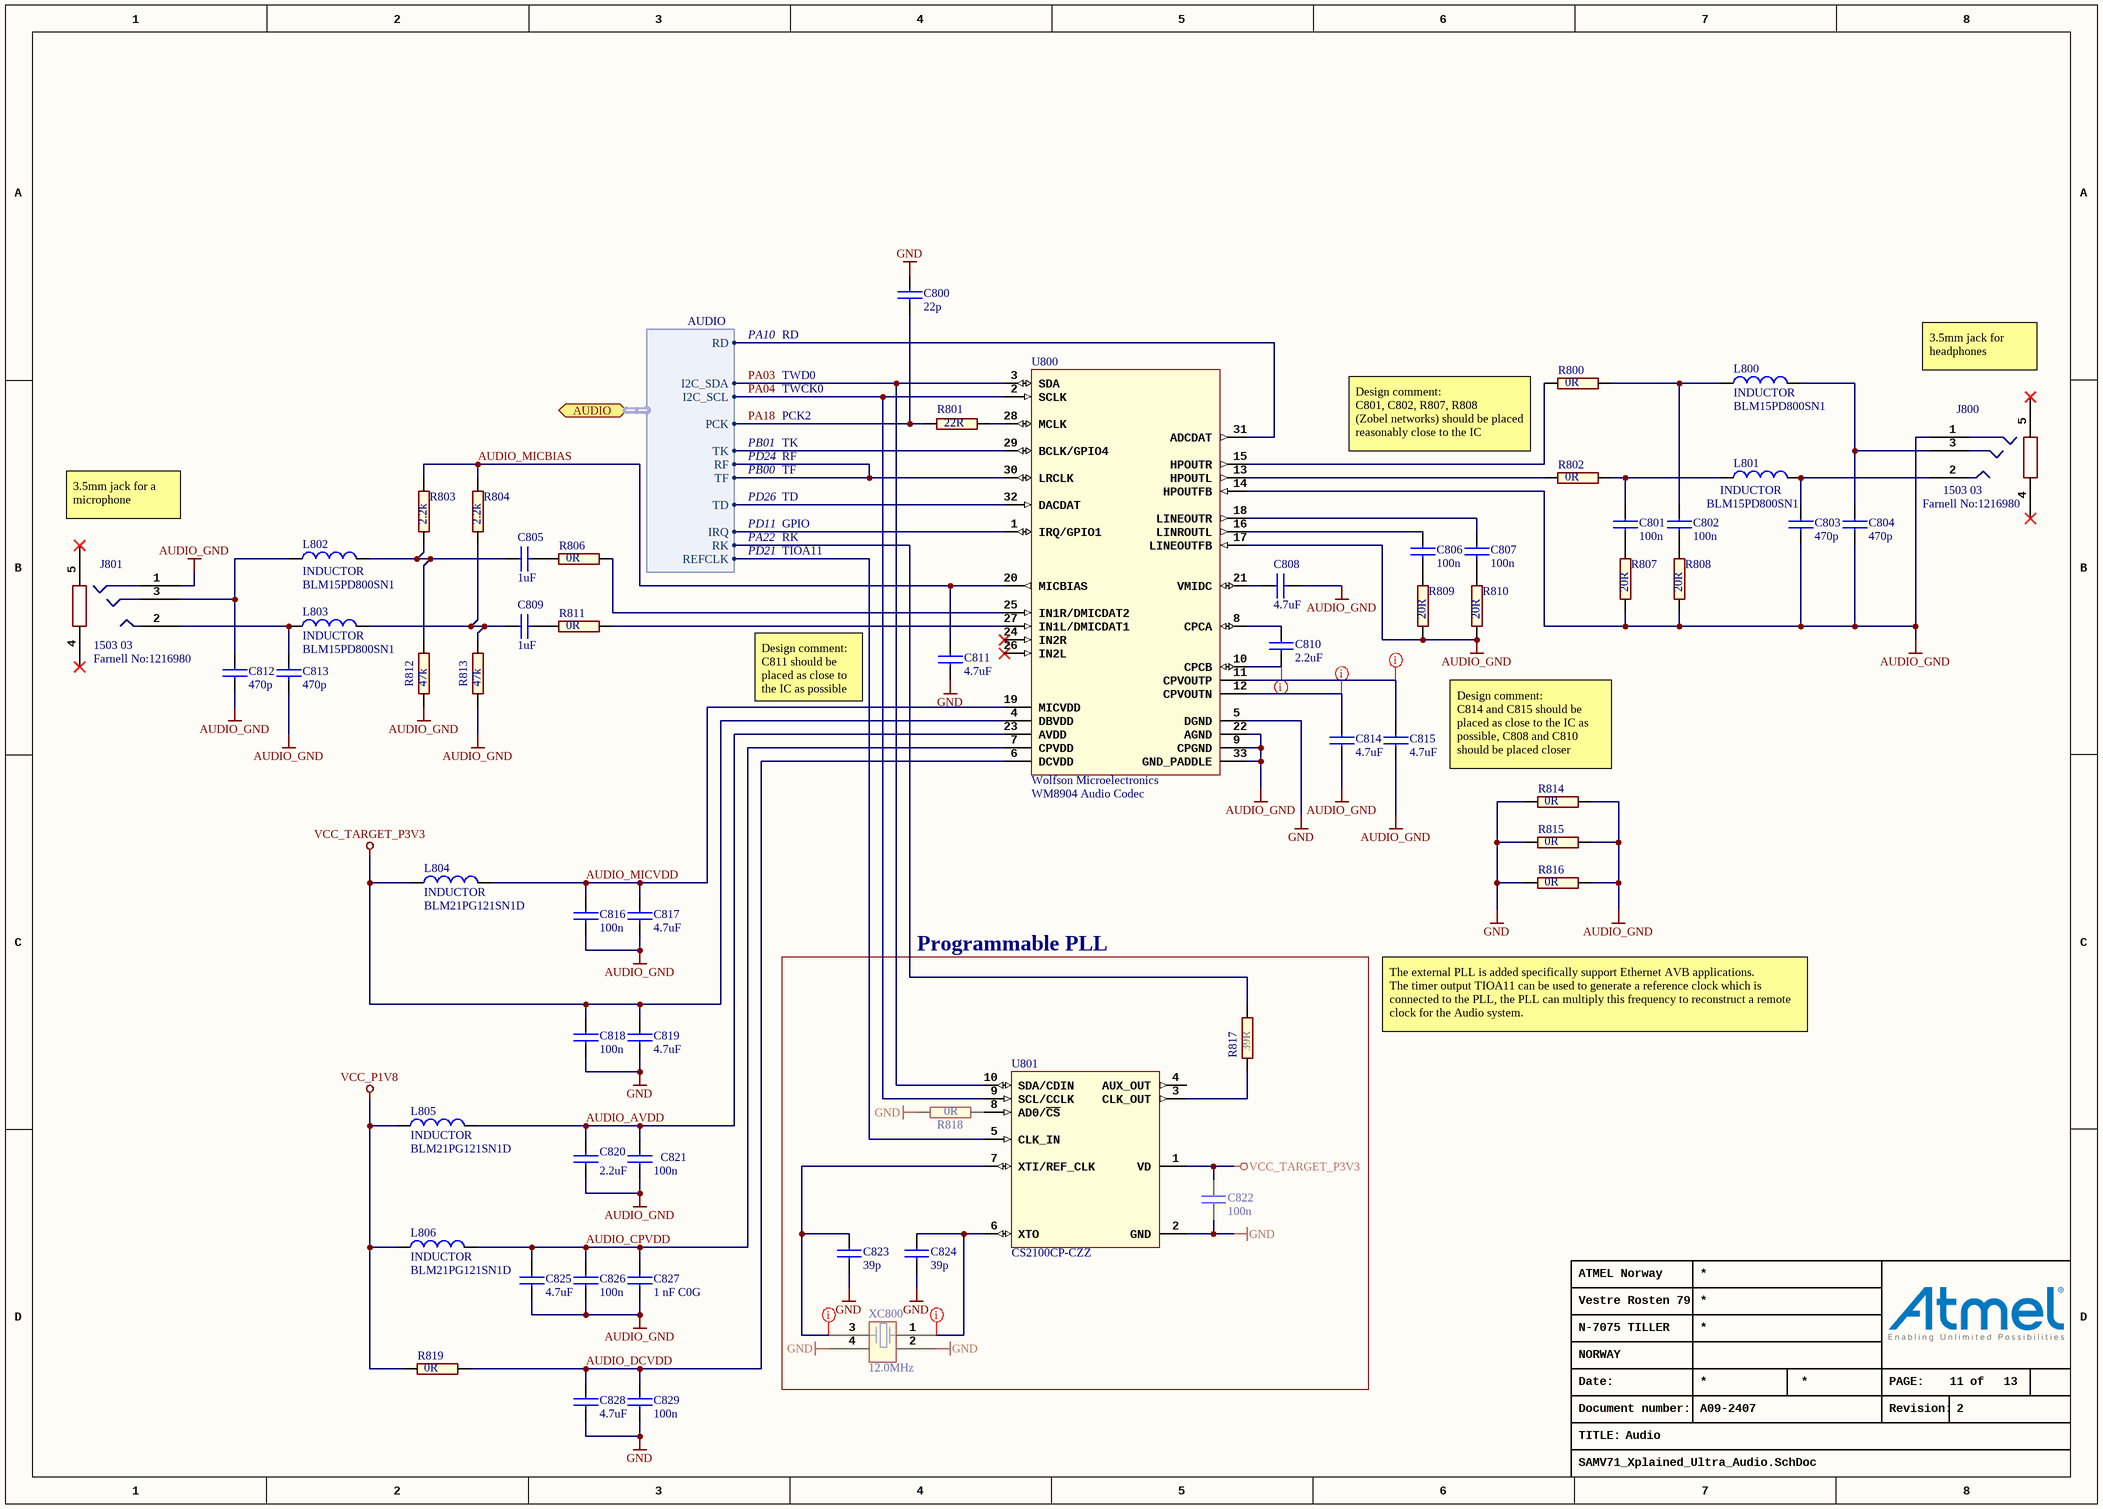
[diagram p10: SAMV71_Xplained_Ultra_Audio.SchDoc]

### Parts
C800  value 22p  [AP1-00001]  (hidden comment: CAP-NONPOL)
C801  value 100n  [AP1-00001]  (hidden comment: CAP-NONPOL)
C802  value 100n  [AP1-00001]  (hidden comment: CAP-NONPOL)
C803  value 470p  [AP1-00001]  (hidden comment: 8819904  @ element14)
C804  value 470p  [AP1-00001]  (hidden comment: 8819904  @ element14)
C805  value 1uF  [AP1-00038]  (hidden comment: CAP-NONPOL)
C806  value 100n  [AP1-00001]  (hidden comment: CAP-NONPOL)
C807  value 100n  [AP1-00001]  (hidden comment: CAP-NONPOL)
C808  value 4.7uF  [AP1-00039]  (hidden comment: CAP-NONPOL)
C809  value 1uF  [AP1-00038]  (hidden comment: CAP-NONPOL)
C810  value 2.2uF  [AP1-00001]  (hidden comment: Farnell no: 1288200)
C811  value 4.7uF  [AP1-00039]  (hidden comment: CAP-NONPOL)
C812  value 470p  [AP1-00001]  (hidden comment: CAP-NONPOL)
C813  value 470p  [AP1-00001]  (hidden comment: CAP-NONPOL)
C814  value 4.7uF  [AP1-00001]
C815  value 4.7uF  [AP1-00001]
C816  value 100n  [AP1-00001]  (hidden comment: CAP-NONPOL)
C817  value 4.7uF  [AP1-00039]  (hidden comment: CAP-NONPOL)
C818  value 100n  [AP1-00001]  (hidden comment: CAP-NONPOL)
C819  value 4.7uF  [AP1-00039]  (hidden comment: CAP-NONPOL)
C820  value 2.2uF  [AP1-00001]  (hidden comment: Farnell no: 1288200)
C821  value 100n  [AP1-00001]  (hidden comment: CAP-NONPOL)
C822  value 100n  [AP1-00001]  (hidden comment: CAP-NONPOL)
C823  value 39p  [AP1-00001]  (hidden comment: CAP-NONPOL)
C824  value 39p  [AP1-00001]  (hidden comment: CAP-NONPOL)
C825  value 4.7uF  [AP1-00039]  (hidden comment: CAP-NONPOL)
C826  value 100n  [AP1-00001]  (hidden comment: CAP-NONPOL)
C827  value 1 nF C0G  [AP1-00001]  (hidden comment: CAP-NONPOL)
C828  value 4.7uF  [AP1-00039]  (hidden comment: CAP-NONPOL)
C829  value 100n  [AP1-00001]  (hidden comment: CAP-NONPOL)
J800  Farnell No:1216980  value 1503 03  [AP8-00397]
J801  Farnell No:1216980  value 1503 03  [AP8-00397]
L800  INDUCTOR  value BLM15PD800SN1  [AP3-00028]
L801  INDUCTOR  value BLM15PD800SN1  [AP3-00028]
L802  INDUCTOR  value BLM15PD800SN1  [AP3-00028]
L803  INDUCTOR  value BLM15PD800SN1  [AP3-00028]
L804  INDUCTOR  value BLM21PG121SN1D  [AP3-00104]
L805  INDUCTOR  value BLM21PG121SN1D  [AP3-00104]
L806  INDUCTOR  value BLM21PG121SN1D  [AP3-00104]
R800  value 0R  [AP2-00000]  (hidden comment: R2)
R801  value 22R  [AP2-00000]  (hidden comment: R2)
R802  value 0R  [AP2-00000]  (hidden comment: R2)
R803  value 2.2k  [AP2-00000]  (hidden comment: R2)
R804  value 2.2k  [AP2-00000]  (hidden comment: R2)
R806  value 0R  [AP2-00000]  (hidden comment: R2)
R807  value 20R  [AP2-00000]  (hidden comment: R2)
R808  value 20R  [AP2-00000]  (hidden comment: R2)
R809  value 20R  [AP2-00000]  (hidden comment: R2)
R810  value 20R  [AP2-00000]  (hidden comment: R2)
R811  value 0R  [AP2-00000]  (hidden comment: R2)
R812  value 47k  [AP2-00000]  (hidden comment: R2)
R813  value 47k  [AP2-00000]  (hidden comment: R2)
R814  value 0R  [AP2-00000]  (hidden comment: R2)
R815  value 0R  [AP2-00000]  (hidden comment: R2)
R816  value 0R  [AP2-00000]  (hidden comment: R2)
R817  value 39R  [AP2-00000]  (hidden comment: R2)
R818  value 0R  [AP2-00000]  (hidden comment: R2)
R819  value 0R  [AP2-00000]  (hidden comment: R2)
U800  Wolfson Microelectronics  value WM8904 Audio Codec  [AP6-00420]
U801  value CS2100CP-CZZ  [AP6-00097]  (hidden comment: CS2100)
XC800  value 12.0MHz  [AP7-00039]  (hidden comment: CRYSTAL1324)

### Blocks framed on the sheet
Programmable PLL: C822-C824 R817 R818 U801 XC800

### Ports
AUDIO (harness AUDIO)

### Harnesses
AUDIO: I2C_SDA, I2C_SCL, PCK, TK, RK, TF, RD, TD, IRQ, REFCLK, RF

### Nets
AUDIO_GND: C803.2 C804.2 C808.2 C812.2 C813.2 C814.2 C815.2 C816.2 C817.2 C820.2 C821.2 C825.2 C826.2 C827.2 J800.1(GND) J801.1(GND) R807.1 R808.1 R809.1 R810.1 R812.1 R813.1 R814.2 R815.2 R816.2 U800.9(CPGND) U800.14(HPOUTFB) U800.17(LINEOUTFB) U800.22(AGND) U800.33(GND_PADDLE)
GND: C800.1 C811.2 C818.2 C819.2 C822.2 C823.2 C824.2 C828.2 C829.2 R814.1 R815.1 R816.1 R818.1 U800.5(DGND) U801.2(GND) XC800.2 XC800.4
VCC_P1V8: L805.1 L806.1 R819.1
VCC_TARGET_P3V3: C818.1 C819.1 C822.1 L804.1 U800.4(DBVDD) U801.1(VD)
AUDIO_AVDD: C820.1 C821.1 L805.2 U800.23(AVDD)
AUDIO_CPVDD: C825.1 C826.1 C827.1 L806.2 U800.7(CPVDD)
AUDIO_DCVDD: C828.1 C829.1 R819.2 U800.6(DCVDD)
AUDIO_MICBIAS: C811.1 R803.2 R804.2 U800.20(MICBIAS)
AUDIO_MICVDD: C816.1 C817.1 L804.2 U800.19(MICVDD)
PA03: U800.3(SDA) U801.10(SDA/CDIN) ; port AUDIO.I2C_SDA
PA04: U800.2(SCLK) U801.9(SCL/CCLK) ; port AUDIO.I2C_SCL
PA18: C800.2 R801.1 ; port AUDIO.PCK
NetC801_1: C801.1 L801.1 R802.2
NetC801_2: C801.2 R807.2
NetC802_1: C802.1 L800.1 R800.2
NetC802_2: C802.2 R808.2
NetC803_1: C803.1 J800.2 L801.2
NetC804_1: C804.1 J800.3 L800.2
NetC805_1: C805.1 L802.2 R803.1 R812.2
NetC805_2: C805.2 R806.1
NetC806_1: C806.1 U800.16(LINROUTL)
NetC806_2: C806.2 R809.2
NetC807_1: C807.1 U800.18(LINEOUTR)
NetC807_2: C807.2 R810.2
NetC808_1: C808.1 U800.21(VMIDC)
NetC809_1: C809.1 L803.2 R804.1 R813.2
NetC809_2: C809.2 R811.1
NetC810_1: C810.1 U800.8(CPCA)
NetC810_2: C810.2 U800.10(CPCB)
NetC812_1: C812.1 J801.3 L802.1
NetC813_1: C813.1 J801.2 L803.1
NetC814_1: C814.1 U800.12(CPVOUTN)
NetC815_1: C815.1 U800.11(CPVOUTP)
NetC823_1: C823.1 U801.7(XTI/REF_CLK) XC800.3
NetC824_1: C824.1 U801.6(XTO) XC800.1
NetR200_2: U800.1(IRQ/GPIO1) ; port AUDIO.IRQ
NetR223_2: U800.30(LRCLK) ; port AUDIO.TF, port AUDIO.RF
NetR224_2: U800.29(BCLK/GPIO4) ; port AUDIO.TK
NetR225_2: R817.2 ; port AUDIO.RK
NetR228_2: U800.31(ADCDAT) ; port AUDIO.RD
NetR229_2: U800.32(DACDAT) ; port AUDIO.TD
NetR230_2: U801.5(CLK_IN) ; port AUDIO.REFCLK
NetR800_1: R800.1 U800.15(HPOUTR)
NetR801_2: R801.2 U800.28(MCLK)
NetR802_1: R802.1 U800.13(HPOUTL)
NetR806_2: R806.2 U800.25(IN1R/DMICDAT2)
NetR811_2: R811.2 U800.27(IN1L/DMICDAT1)
NetR817_1: R817.1 U801.3(CLK_OUT)
NetR818_2: R818.2 U801.8(AD0/~{CS})

Not connected (* = marked no-connect by the designer): J800 4* 5*; J801 4* 5*; U800 24(IN2R)* 26(IN2L)*; U801 4(AUX_OUT)

### Layout directives
rule Assembly Testpoint Usage [Testpoint - Not Allowed    Multiple - Not Allowed]; rule Fabrication Testpoint Usage [Testpoint - Not Allowed    Multiple - Not Allowed]: NetC823_1, NetC824_1
rule Fabrication Testpoint Usage [Testpoint - Not Allowed    Multiple - Not Allowed]; rule Assembly Testpoint Usage [Testpoint - Not Allowed    Multiple - Not Allowed]: NetC810_2, NetC814_1, NetC815_1

### Notes on the sheet
- PA10
- RD
- TWD0
- 3.5mm jack for headphones
- PB01
- TWCK0
- PCK2
- TK
- Design comment:
  C801, C802, R807, R808
  (Zobel networks) should be placed reasonably close to the IC
- 3.5mm jack for a microphone
- PD24
- PB00
- PD26
- RF
- TF
- TD
- PA22
- PD21
- PD11
- GPIO
- RK
- TIOA11
- Design comment:
  C811 should be placed as close to the IC as possible
- Design comment:
  C814 and C815 should be placed as close to the IC as possible, C808 and C810 should be placed closer
- The external PLL is added specifically support Ethernet AVB applications.
  The timer output TIOA11 can be used to generate a reference clock which is connected to the PLL, the PLL can multiply this frequency to reconstruct a remote clock for the Audio system.
- Date:
- PAGE:
- of
- TITLE:
- Document number:
- Revision:

### Library data of the parts
C800 = A01-0019: Ceramic capacitor, SMD 0402, NP0, 50V, +/-5%; PartGroup: Capacitors,Ceramic,SMD 0402; TemperatureRange: -55 - +125 deg C; AN: A01-0019; Tolerance: 50V, +/-5%; Height: 0.550000011920929
C801 C802 C806 C807 C816 C818 C821 C822 C826 C829 = A01-0246: as C600-C602 on sheet SAMV71_Xplained_Ultra_Memory; AN: A01-0246; Tolerance: 16V, +/-10%; Height: 0.5
C803 C804 C812 C813 = A01-0034: Ceramic capacitor, SMD 0402, X7R, 50V, +/-10%; PartGroup: Capacitors,Ceramic,SMD 0402; TemperatureRange: -55 - +125 deg C; AN: A01-0034; Tolerance: 50V, +/-10%
  C803 C804: Height: 0,550000011920929
  C812 C813: Height: 0.550000011920929
C805 C809 = A01-0447: Ceramic capacitor, SMD 0402, X5R, 10V, ±10 %; PartGroup: Capacitors,Ceramic,SMD 0402; Manufacturer: AVX; MPN: 0402ZD105KAT2A; AN: A01-0447; Height: 0.560000002384186
C808 C811 C817 C819 C825 C828 = A01-0377: Ceramic capacitor, SMD 0603, X5R, 10V, 10% (de31036); PartGroup: Capacitors,Ceramic,SMD 0603; Manufacturer: tdk; MPN: C1608X5R1A475K; TemperatureRange: -55 - +85 deg C; AN: A01-0377; Tolerance: 10%; Height: 0.800000011920929
C810 C820 = A01-0300: as C603 on sheet SAMV71_Xplained_Ultra_Memory; AN: A01-0300; Height: 0.5
C814 C815 = A01-0347: Ceramic capacitor, SMD 0402, X5R, 6.3V, +/-20% (de33687); PartGroup: Capacitors,Ceramic,SMD 0402; Manufacturer: Murata; MPN: GRM155R60J475ME87D; Tolerance: +-20%; TemperatureRange: -55°C to +85°C; AN: A01-0347; Height: 0,5
C823 C824 = A01-0022: Ceramic capacitor, SMD 0402, NP0, 50V, +/-5%; PartGroup: Capacitors,Ceramic,SMD 0402; TemperatureRange: -55 - +125 deg C; AN: A01-0022; Tolerance: 50V, +/-5%; Height: 0,550000011920929
C827 = A01-0321: Ceramic capacitor, SMD 0402, C0G, 50V, +/-5%; PartGroup: Capacitors,Ceramic,SMD 0402; Manufacturer: Murata; MPN: GRM1555C1H102JA01D; Tolerance: 5%; AN: A01-0321; Height: 0.550000011920929
J800 J801 = A08-0886: 3.5mm stereo phone jack; PartGroup: Mechanical devices,Connectors,Other; Manufacturer: Lumberg; AN: A08-0886; Height: 5; MPN: 1503 03
L800-L803 = A03-0142: FERRITE CHIP 80 OHM 1500MA 0402; PartGroup: Inductors,EMI; Manufacturer: Murata; Tolerance: ±25%; TemperatureRange: -55 ° C to +125 ° C; AN: A03-0142; Height: 0.5; MPN: BLM15PD800SN1
L804-L806 = A03-0167: SMD EMI FERRITE 0805, Z=120 ohm(@100MHz), Max R(dc)=0.03 ohm, Max current=3A, (Digikey:490-5986-2-ND); PartGroup: Inductors,EMI; Manufacturer: Murata; TemperatureRange: -55 to +125Â°C; AN: A03-0167; Height: 0.899999976158142; MPN: BLM21PG121SN1D
R800 R802 R806 R811 R814-R816 R818 R819 = A02-0163: RES 0.0 OHM 1/16W 0402 SMD; PartGroup: Resistors,SMD,0402 1%; Manufacturer: (n/a); MPN: RMCF0402ZT0R00; Tolerance: 1 %; TemperatureRange: -55 - +125 deg C; AN: A02-0163; Height: 0.349999994039536
R801 = A02-0172: Thick film resistor, SMD 0402, 1/16W, 1% (de23607); PartGroup: Resistors,SMD,0402 1%; Manufacturer: Samsung; MPN: RC100SF22R0CS; TemperatureRange: -55 - +125 deg C; AN: A02-0172; Tolerance: 1 %; Height: 0.349999994039536
R803 R804 = A02-0220: Thick film resistor, SMD 0402, 1/16W, 1%; PartGroup: Resistors,SMD,0402 1%; TemperatureRange: -55 - +125 deg C; AN: A02-0220; Tolerance: 1 %; Height: 0.349999994039536
R807-R810 = A02-0171: Thick film resistor, SMD 0402, 1/16W, 1%; PartGroup: Resistors,SMD,0402 1%; TemperatureRange: -55 - +125 deg C; AN: A02-0171; Tolerance: 1 %; Height: 0.349999994039536
R812 R813 = A02-0252: Thick film resistor, SMD 0402, 1/16W, 1%; PartGroup: Resistors,SMD,0402 1%; TemperatureRange: -55 - +125 deg C; AN: A02-0252; Tolerance: 1 %; Height: 0.349999994039536
R817 = A02-0178: Thick film resistor, SMD 0402, 1/16W, 1%; PartGroup: Resistors,SMD,0402 1%; TemperatureRange: -55 - +125 deg C; AN: A02-0178; Tolerance: 1 %; Height: 0.349999994039536
U800 = A06-1156: Ultra Low Power Codec for Portable Audio Applications; PartGroup: Integrated Circuits,Special function,Mixed signal; TemperatureRange: -40C to +85C; AN: A06-1156; Height: 0,800000011920929
U801 = A06-1177: Programmable Phase-Locked Loop Clock Generator; PartGroup: Integrated Circuits,Special function,Oscillator; TemperatureRange: -10Â°C to +70Â°C; AN: A06-1177; Height: 1,10000002384186
XC800 = A07-0042: Fox FQ5032B 12.0MHz SMD crystal 738B-12; PartGroup: Frequency devices,Crystals,SMD; Manufacturer: Fox  Electronics; MPN: FQ5032B-12-C-C-C-200-1 / 738B-12; Tolerance: 30PPM; AN: A07-0042; Height: 1,20000004768372

## Sheet SAMV71_Xplained_Ultra_MCU_Peripherals.SchDoc: Target MCU Peripherals
size A3; Organization: ATMEL Norway; Address1: Vestre Rosten 79; Address2: N-7075 TILLER; Address3: NORWAY; DocumentNumber: A09-2407; Revision: 2; SheetNumber: 6; SheetTotal: 13; PageSetup: Record=PageOptions|CenterHorizontal=True|CenterVertical=True|PrintScale=1.01|XCorrection=1.00|YCorrection=1.00|PrintKind=1|BorderSize=5000000|LeftOffset=0|BottomOffset=0|Orientation=2|PaperLength=1000|PaperWidth=1000|Scale=100|PaperSource=7|PrintQuality=-4|MediaType=1|DitherType=10|PaperKind=A3 (297 x 420 mm)|PrintScaleMode=1
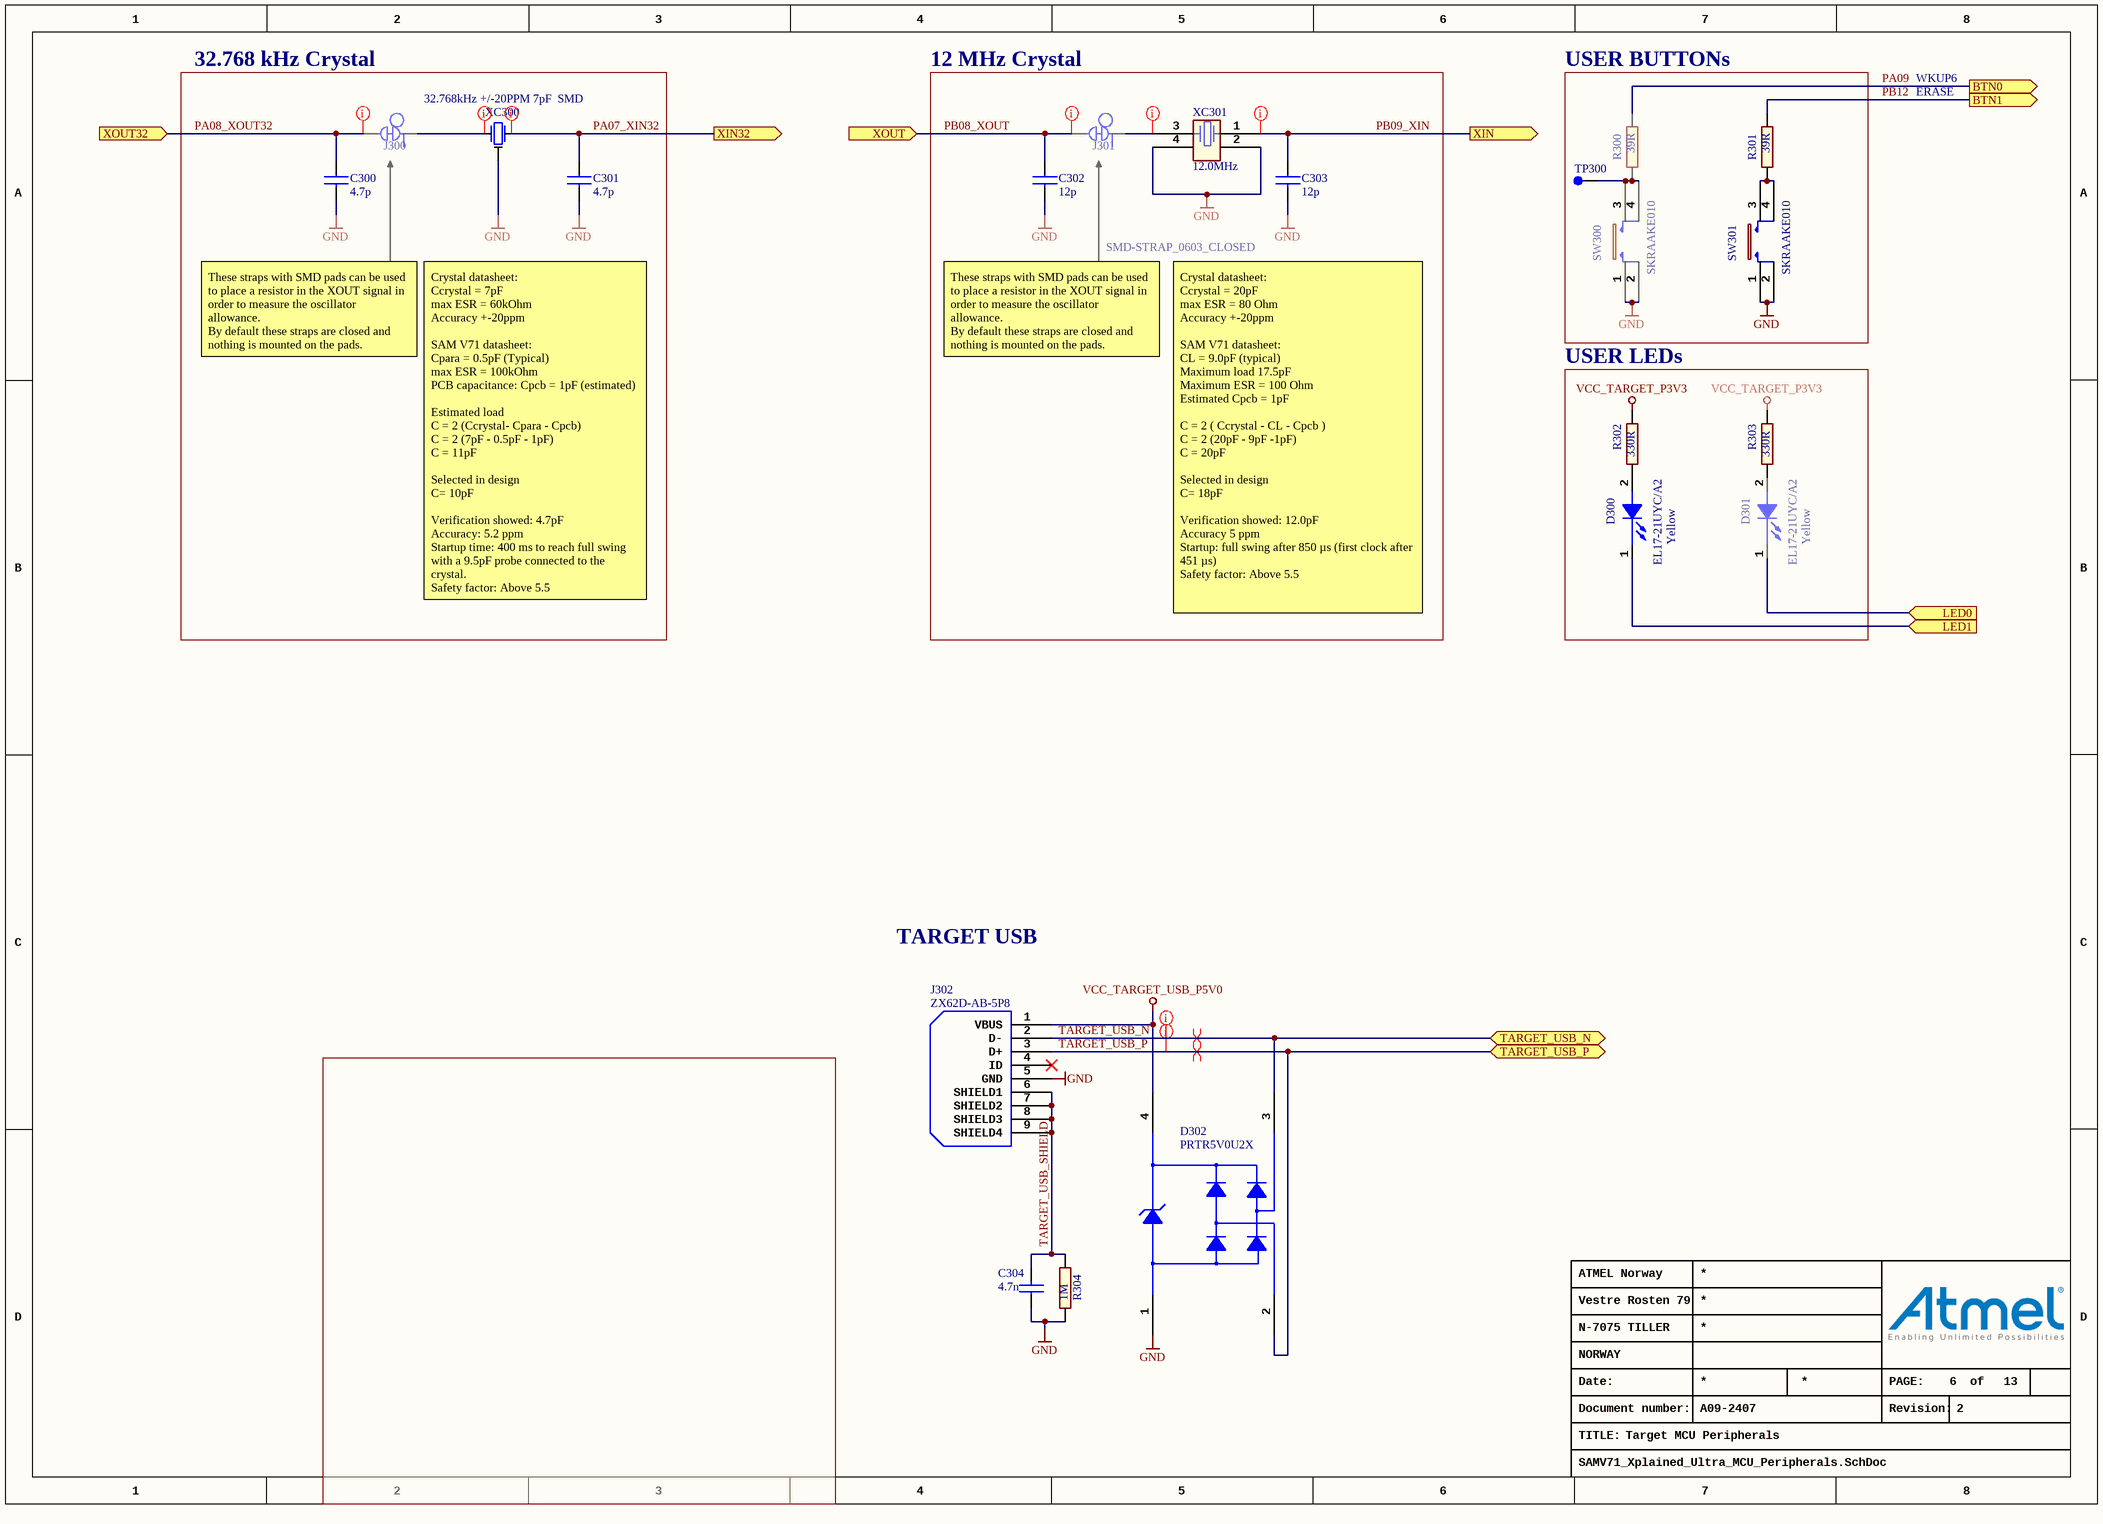
[diagram p11: SAMV71_Xplained_Ultra_MCU_Peripherals.SchDoc]

### Parts
C300  value 4.7p  [AP1-00001]  (hidden comment: CAP-NONPOL)
C301  value 4.7p  [AP1-00001]  (hidden comment: CAP-NONPOL)
C302  value 12p  [AP1-00001]  (hidden comment: CAP-NONPOL)
C303  value 12p  [AP1-00001]  (hidden comment: CAP-NONPOL)
C304  value 4.7n  [AP1-00053]  (hidden comment: CAP-NONPOL)
D300  Yellow  value EL17-21UYC/A2  [AP4-00013]
D301  Yellow  value EL17-21UYC/A2  [AP4-00013]
D302  PRTR5V0U2X  [AP4-00001]
J300  (no value)  [AP9-00044]  (net tie, no BOM)
J301  value SMD-STRAP_0603_CLOSED  [AP9-00044]  (net tie, no BOM)
J302  value ZX62D-AB-5P8  [AP8-00852]  (hidden comment: 2,000 pieces per reel)
R300  value 39R  [AP2-00011]  (hidden comment: R2)
R301  value 39R  [AP2-00011]  (hidden comment: R2)
R302  value 330R  [AP2-00000]  (hidden comment: R2)
R303  value 330R  [AP2-00000]  (hidden comment: R2)
R304  value 1M  [AP2-00011]  (hidden comment: R2)
SW300  value SKRAAKE010  [AP8-00137]  (hidden comment: Can be ordered in low volumes from Mouser)
SW301  value SKRAAKE010  [AP8-00137]  (hidden comment: Can be ordered in low volumes from Mouser)
TP300  TESTPOINT  [AP8-00010]  (value not drawn)  (no BOM)
XC300  value 32.768kHz +/-20PPM 7pF  SMD  [AP7-00044]  (hidden comment: Farnell order no:1539364)
XC301  value 12.0MHz  [AP7-00039]  (hidden comment: CRYSTAL1324)

### Blocks framed on the sheet
32.768 kHz Crystal: C300 C301 J300 XC300
12 MHz Crystal: C302 C303 J301 XC301
USER BUTTONs: R300 R301 SW300 SW301 TP300
USER LEDs: D300 D301 R302 R303

### Ports
BTN0 (out), BTN1 (out), LED0 (in), LED1 (in), TARGET_USB_N (bidir), TARGET_USB_P (bidir), XIN32 (out), XIN (out), XOUT32 (in), XOUT (in)

### Nets
GND: C300.2 C301.2 C302.2 C303.2 C304.1 D302.1(GND) J302.5(GND) R304.1 SW300.1 SW300.2 SW301.1 SW301.2 XC300.3 XC301.2 XC301.4
VCC_TARGET_P3V3: R302.2 R303.2
VCC_TARGET_USB_P5V0: D302.4(VCC) J302.1(VBUS)
PA07_XIN32: C301.1 XC300.2 ; port XIN32
PA08_XOUT32: C300.1 J300.2 ; port XOUT32
PA09: R300.2 ; port BTN0
PA23: D301.1(CATHODE) ; port LED0
PB08_XOUT: C302.1 J301.2 ; port XOUT
PB09_XIN: C303.1 XC301.1 ; port XIN
PB12: R301.2 ; port BTN1
PC09: D300.1(CATHODE) ; port LED1
TARGET_USB_N: D302.3(I/O_2) J302.2(D-) ; port TARGET_USB_N
TARGET_USB_P: D302.2(I/O_1) J302.3(D+) ; port TARGET_USB_P
TARGET_USB_SHIELD: C304.2 J302.6(SHIELD1) J302.7(SHIELD2) J302.8(SHIELD3) J302.9(SHIELD4) R304.2
NetD300_2: D300.2(ANODE) R302.1
NetD301_2: D301.2(ANODE) R303.1
NetJ300_1: J300.1 XC300.1
NetJ301_1: J301.1 XC301.3
NetR300_1: R300.1 SW300.3 SW300.4 TP300.1
NetR301_1: R301.1 SW301.3 SW301.4

Not connected (* = marked no-connect by the designer): J302 4(ID)*

### Layout directives
differential pair: TARGET_USB_N, TARGET_USB_P
rule Assembly Testpoint Usage [Testpoint - Not Allowed    Multiple - Not Allowed]; rule Fabrication Testpoint Usage [Testpoint - Not Allowed    Multiple - Not Allowed]: NetJ300_1, NetJ301_1, PA07_XIN32, PA08_XOUT32, PB08_XOUT, PB09_XIN, TARGET_USB_N, TARGET_USB_P

### Notes on the sheet
- WKUP6
- ERASE
- These straps with SMD pads can be used to place a resistor in the XOUT signal in order to measure the oscillator allowance.
  By default these straps are closed and nothing is mounted on the pads.
- Crystal datasheet:
  Ccrystal = 7pF
  max ESR = 60kOhm
  Accuracy +-20ppm
  SAM V71 datasheet:
  Cpara = 0.5pF (Typical)
  max ESR = 100kOhm
  PCB capacitance: Cpcb = 1pF (estimated)
  Estimated load
  C = 2 (Ccrystal- Cpara - Cpcb)
  C = 2 (7pF - 0.5pF - 1pF)
  C = 11pF
  Selected in design
  C= 10pF
  Verification showed: 4.7pF
  Accuracy: 5.2 ppm
  Startup time: 400 ms to reach full swing with a 9.5pF probe connected to the crystal.
  Safety factor: Above 5.5
- Crystal datasheet:
  Ccrystal = 20pF
  max ESR = 80 Ohm
  Accuracy +-20ppm
  SAM V71 datasheet:
  CL = 9.0pF (typical)
  Maximum load 17.5pF
  Maximum ESR = 100 Ohm
  Estimated Cpcb = 1pF
  C = 2 ( Ccrystal - CL - Cpcb )
  C = 2 (20pF - 9pF -1pF)
  C = 20pF
  Selected in design
  C= 18pF
  Verification showed: 12.0pF
  Accuracy 5 ppm
  Startup: full swing after 850 µs (first clock after 451 µs)
  Safety factor: Above 5.5
- TARGET USB
- Date:
- PAGE:
- of
- TITLE:
- Document number:
- Revision:

### Library data of the parts
C300 C301 = A01-0011: Ceramic capacitor, SMD 0402, NP0, 50V, +/-0.25pF; PartGroup: Capacitors,Ceramic,SMD 0402; TemperatureRange: -55 - +125 deg C; AN: A01-0011; Tolerance: 50V, +/-0.25pF; Height: 0,550000011920929
C302 C303 = A01-0016: Ceramic capacitor, SMD 0402, NP0, 50V, +/-5%; PartGroup: Capacitors,Ceramic,SMD 0402; TemperatureRange: -55 - +125 deg C; AN: A01-0016; Tolerance: 50V, +/-5%; Height: 0,550000011920929
C304 = A01-0046: Ceramic capacitor, SMD 0402, X7R, 25V, +/-10%; PartGroup: Capacitors,Ceramic,SMD 0402; TemperatureRange: -55 - +125 deg C; AN: A01-0046; Tolerance: 25V, +/-10%; Height: 0.550000011920929
D300 D301 = A10-0019: LED, Yellow, Wave length=591nm, SMD 0805, ±70°; PartGroup: Opto,LEDs,SMD; Manufacturer: Everlight; MPN: 17-21UYC/S530-A3/TR8; TemperatureRange: -40 to +85 deg C; AN: A10-0019; Height: 1,10000002384186
D302 = A06-0236: Double rail-to-rail USB ESD protection diode; OrcadPartType: Integrated Circuits&Special function&Protection; Manufacturer: Philips; TemperatureRange: -40 to +85 C; AN: A06-0236; Value: PRTR5V0U2X; PartType: Buy; Height: 1,10000002384186; MPN: PRTR5V0U2X
J300 = A09-0783: Default closed SMD strap, 0603 size; PartGroup: Mechanical devices,PCB implemented components; Value: SMD-STRAP_0603_CLOSED; AN: A09-0783; Height: 0
J301 = A09-0783: Default closed SMD strap, 0603 size; PartGroup: Mechanical devices,PCB implemented components; AN: A09-0783; Height: 0
J302 = A08-2112: Micro USB AB Connector, Standard SMT + DIP; PartGroup: Mechanical devices,Connectors,USB; AN: A08-2112; Height: 2,79999995231628
R300 R301 = A02-0178: as R817 on sheet SAMV71_Xplained_Ultra_Audio; AN: A02-0178; Tolerance: 1 %; Height: 0,349999994039536
R302 R303 = A02-0200: Thick film resistor, SMD 0402, 1/16W, 1%; PartGroup: Resistors,SMD,0402 1%; TemperatureRange: -55 - +125 deg C; AN: A02-0200; Tolerance: 1 %; Height: 0.349999994039536
R304 = A02-0284: Thick film resistor, SMD 0402, 1/16W, 1%; PartGroup: Resistors,SMD,0402 1%; Manufacturer: KOA; MPN: RK73H1ETTP1004F; TemperatureRange: -55 - +125 deg C; AN: A02-0284; Tolerance: 1 %; Height: 0,349999994039536
SW300 SW301 = A08-0790: 6.2x6.2 mm SMD tact switch, same as A08-0091 but less force is needed; PartGroup: Mechanical devices,Switches,SMD; Manufacturer: ALPS; TemperatureRange: -30 - +90 deg C; AN: A08-0790; Height: 5,09999990463257; MPN: SKRAAKE010
TP300 = A08-0004: as TP600 on sheet SAMV71_Xplained_Ultra_Memory; AN: A08-0004; Height: 0
XC300 = A07-0052: 32k768 crystal, +-20ppm, CL=7pF, max ESR 60kOhm, SMD; PartGroup: Frequency devices,Crystals,SMD; Manufacturer: Micro Crystal; MPN: MS1V-T1K 32.768kHz 7pF +/-20PPM TA; Tolerance: +/- 20 PPM; TemperatureRange: -40 /+85; AN: A07-0052; Height: 2.07999992370605
XC301 = A07-0042: as XC800 on sheet SAMV71_Xplained_Ultra_Audio; AN: A07-0042; Height: 1.20000004768372